# EAGLE schematic AD9910_Finished_3rd (EAGLE 9.6.2)
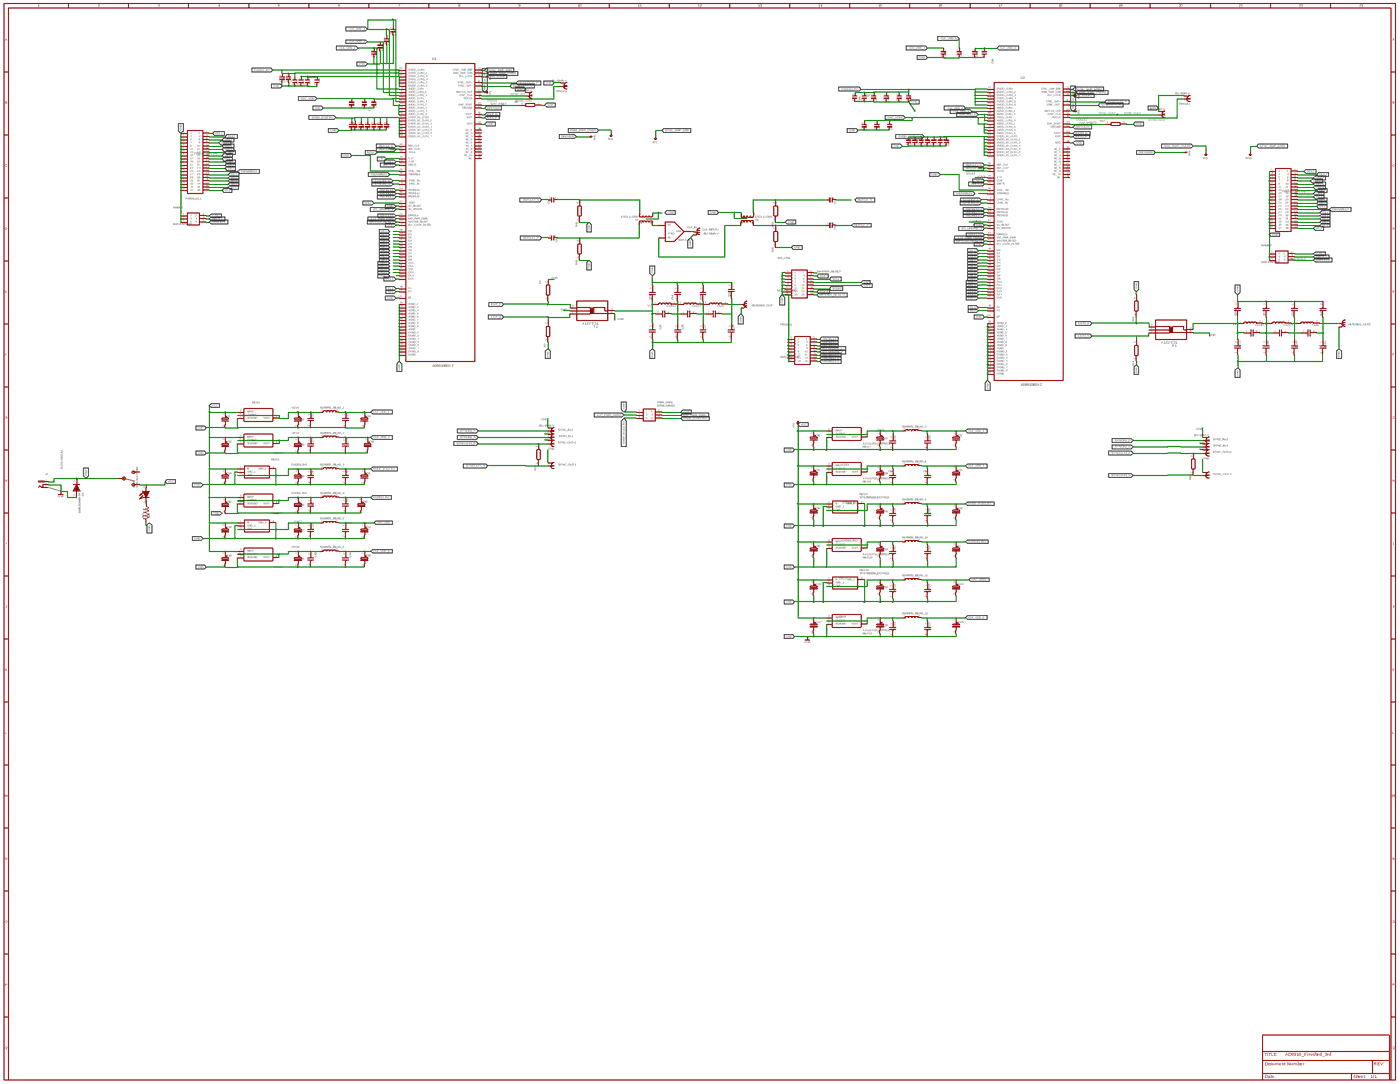
[diagram p0: schematic, sheet 1, overview]
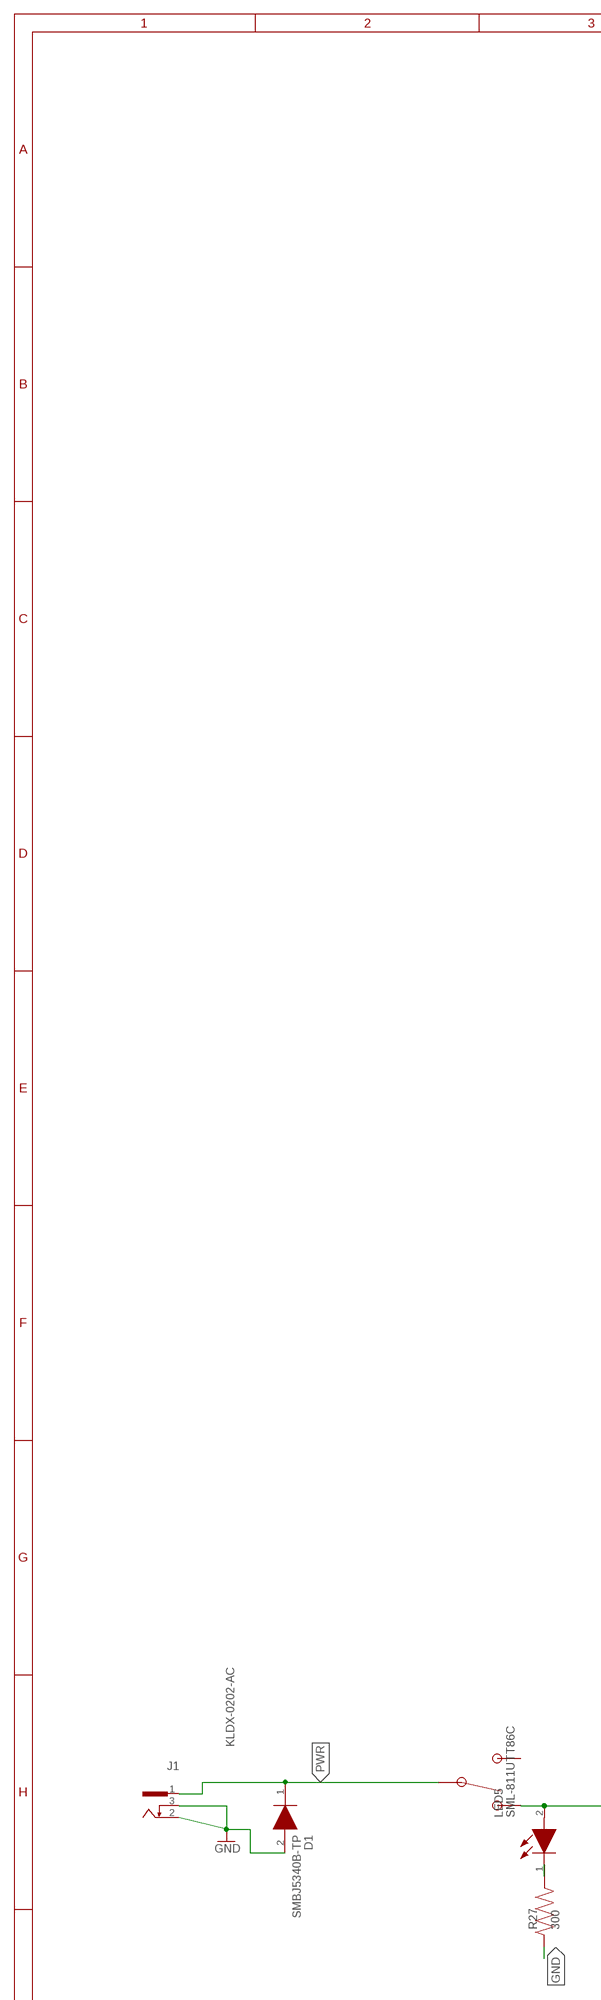
[diagram p1: schematic, sheet 1, part 1 of 7]
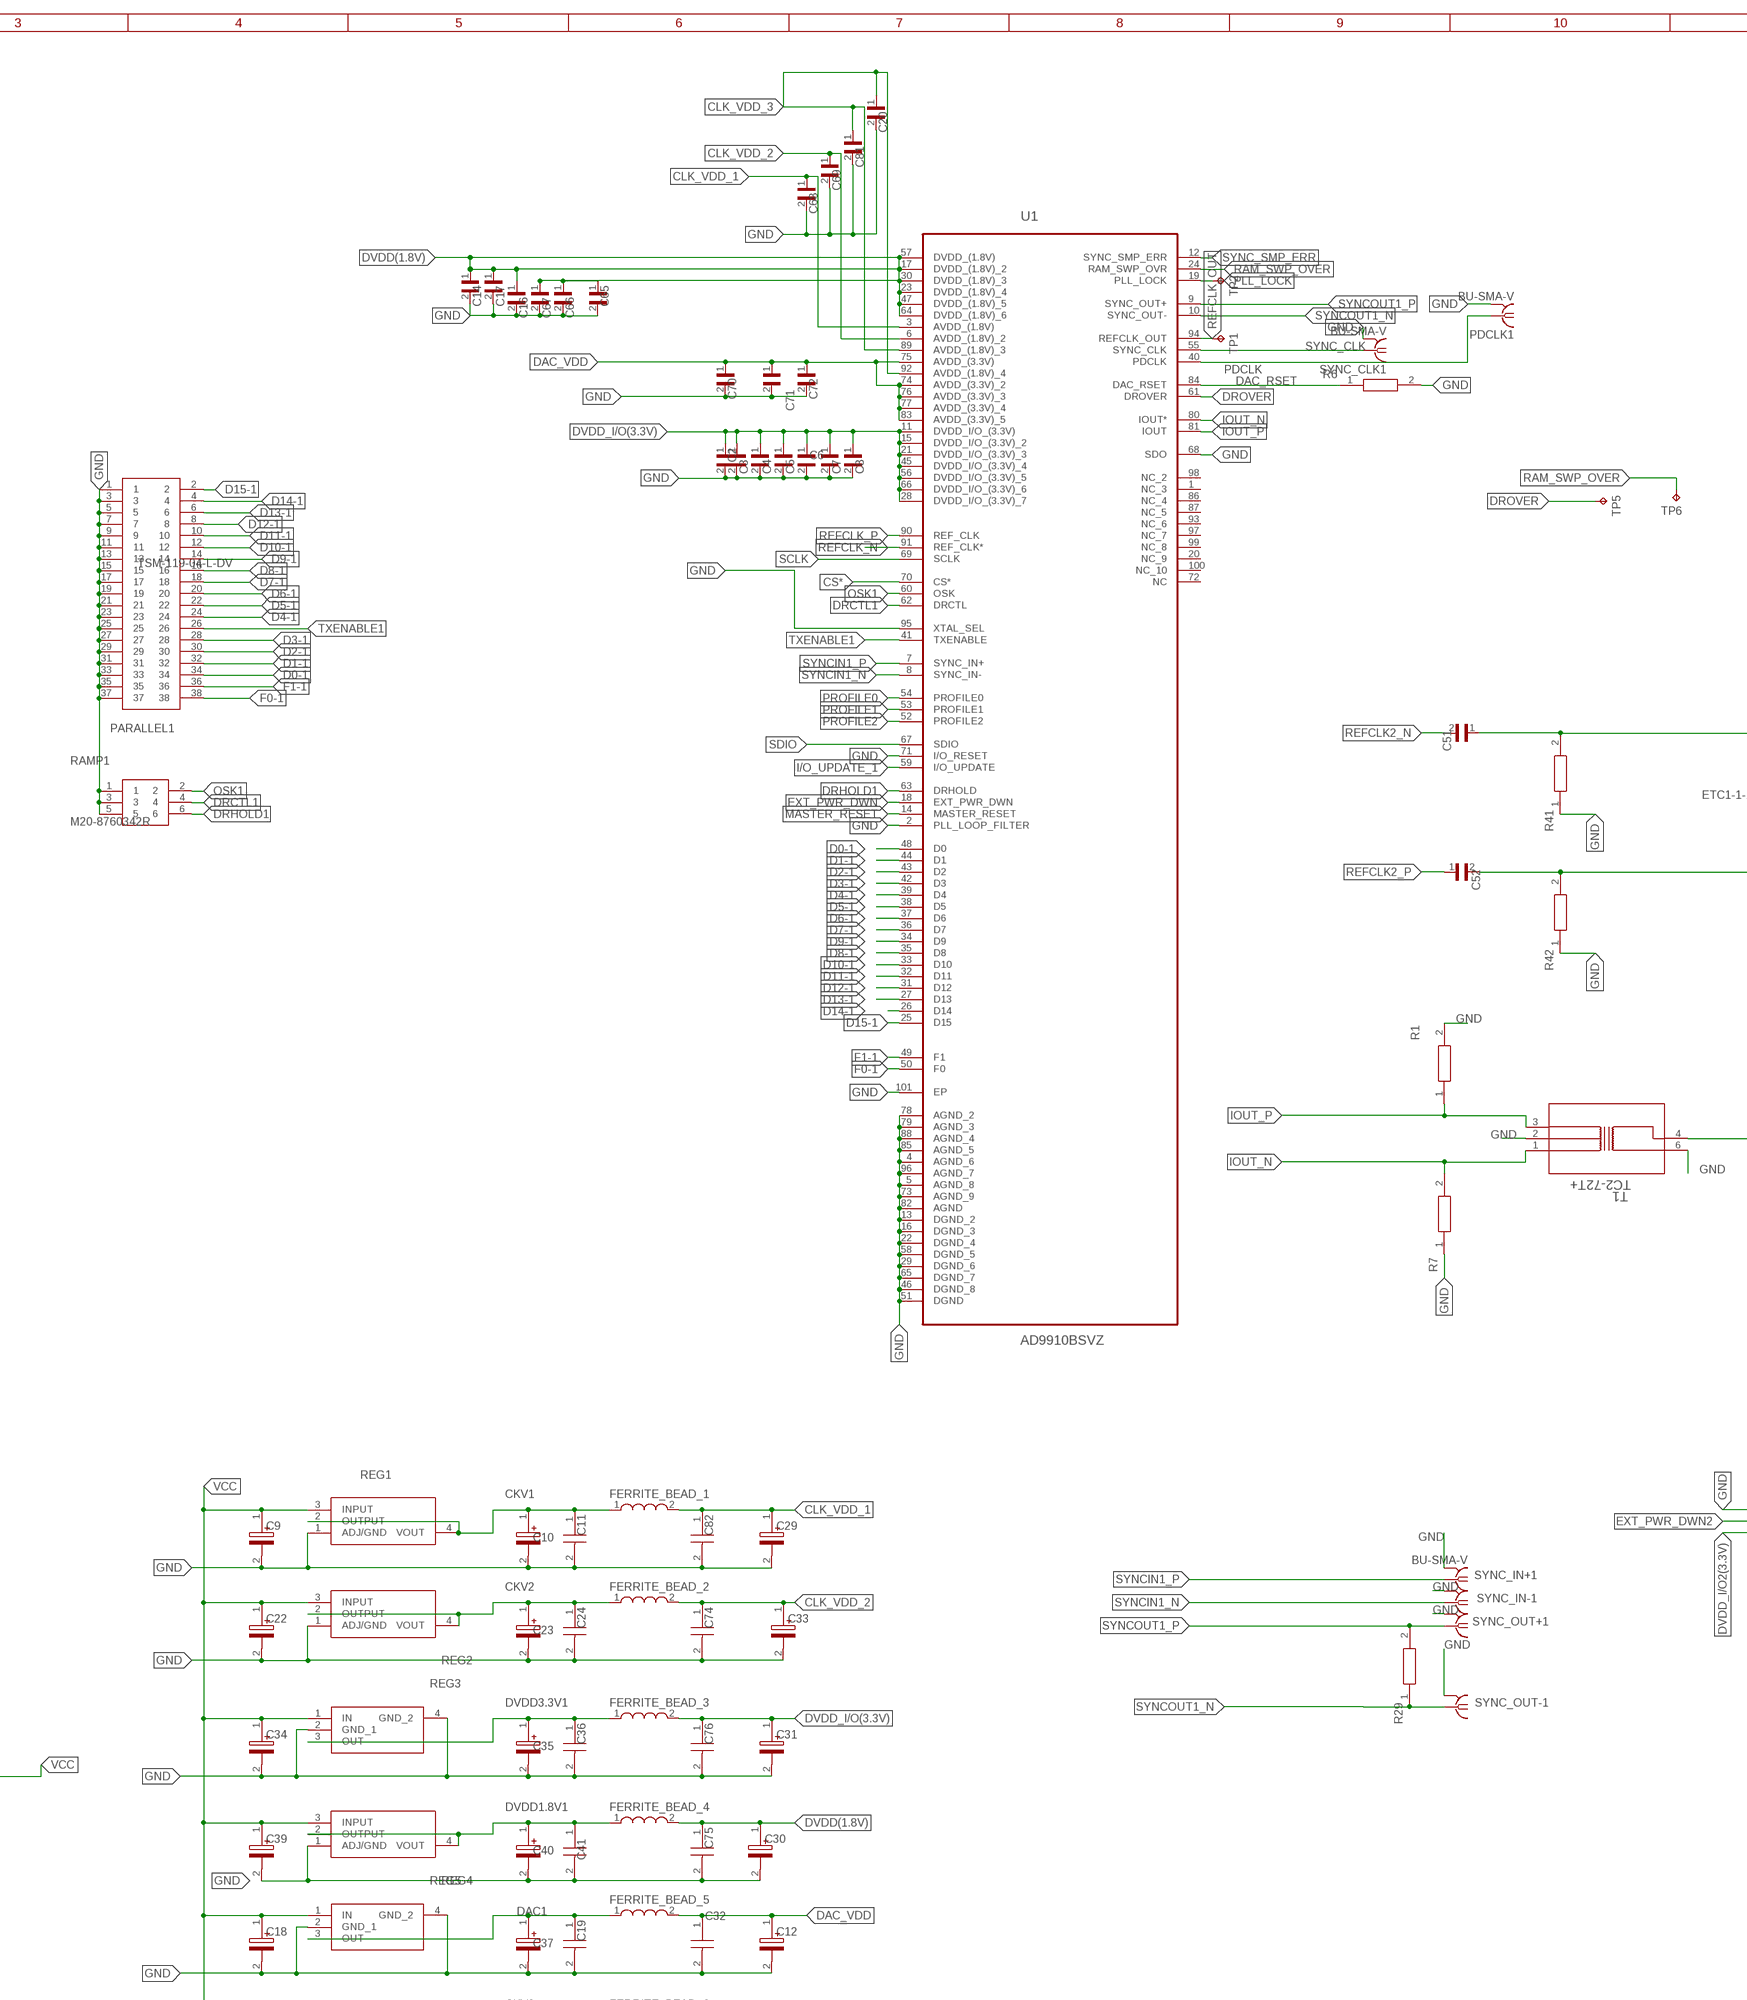
[diagram p2: schematic, sheet 1, part 2 of 7]
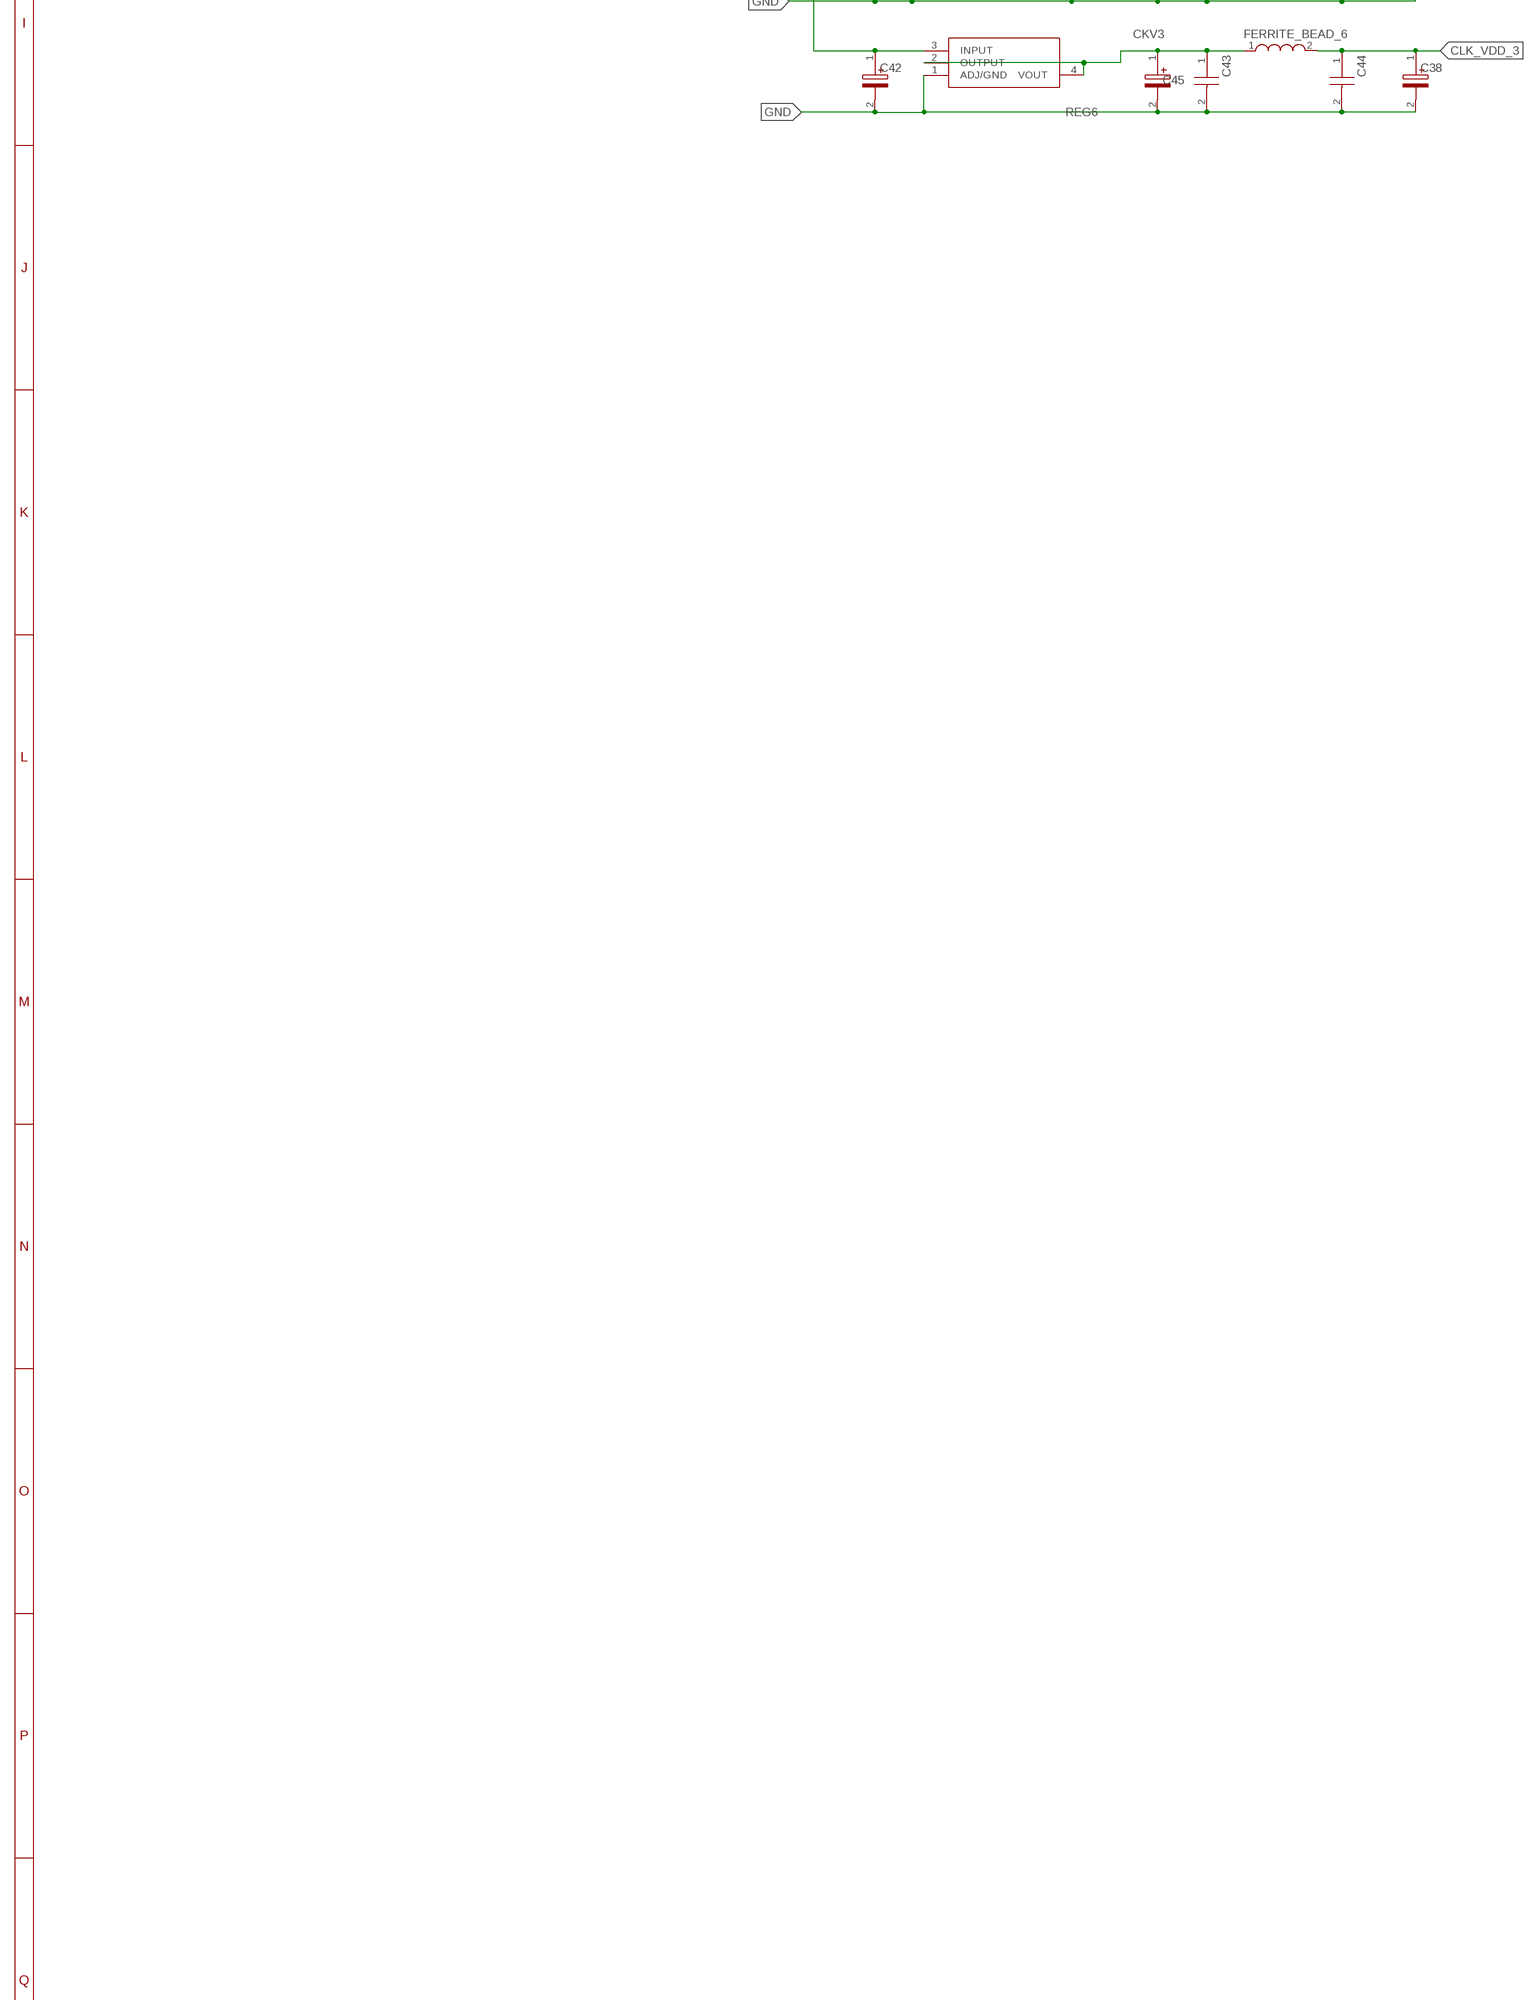
[diagram p3: schematic, sheet 1, part 3 of 7]
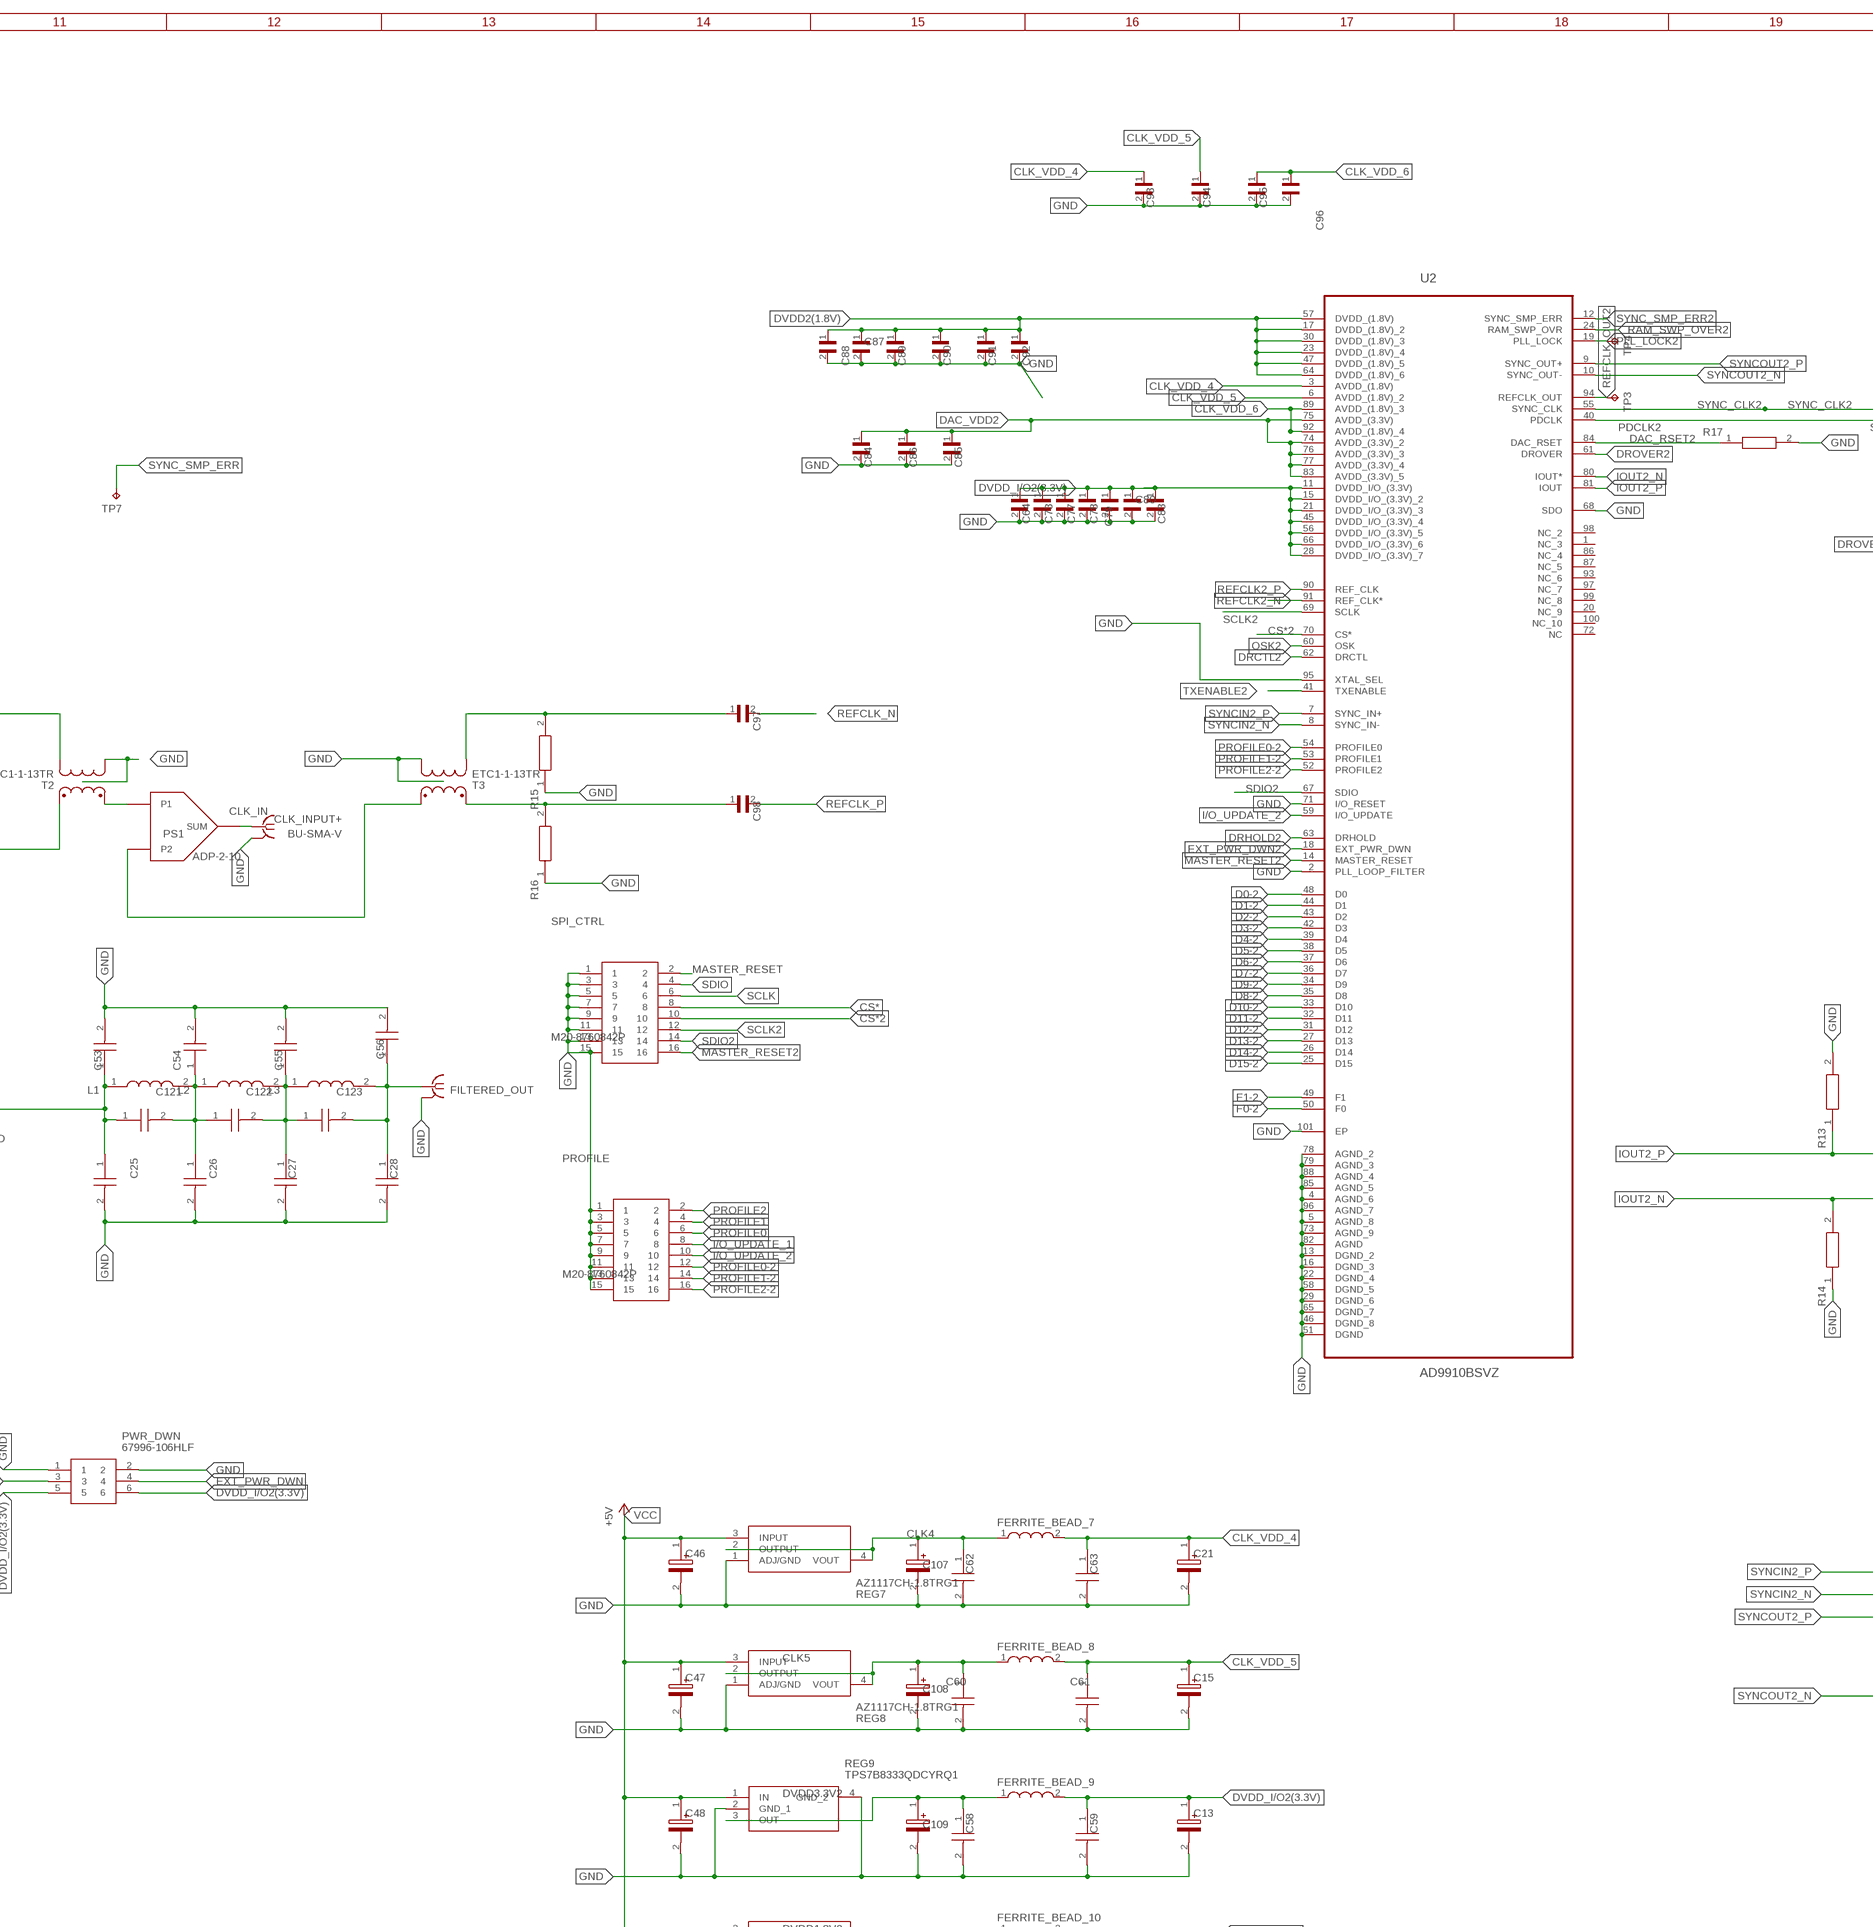
[diagram p4: schematic, sheet 1, part 4 of 7]
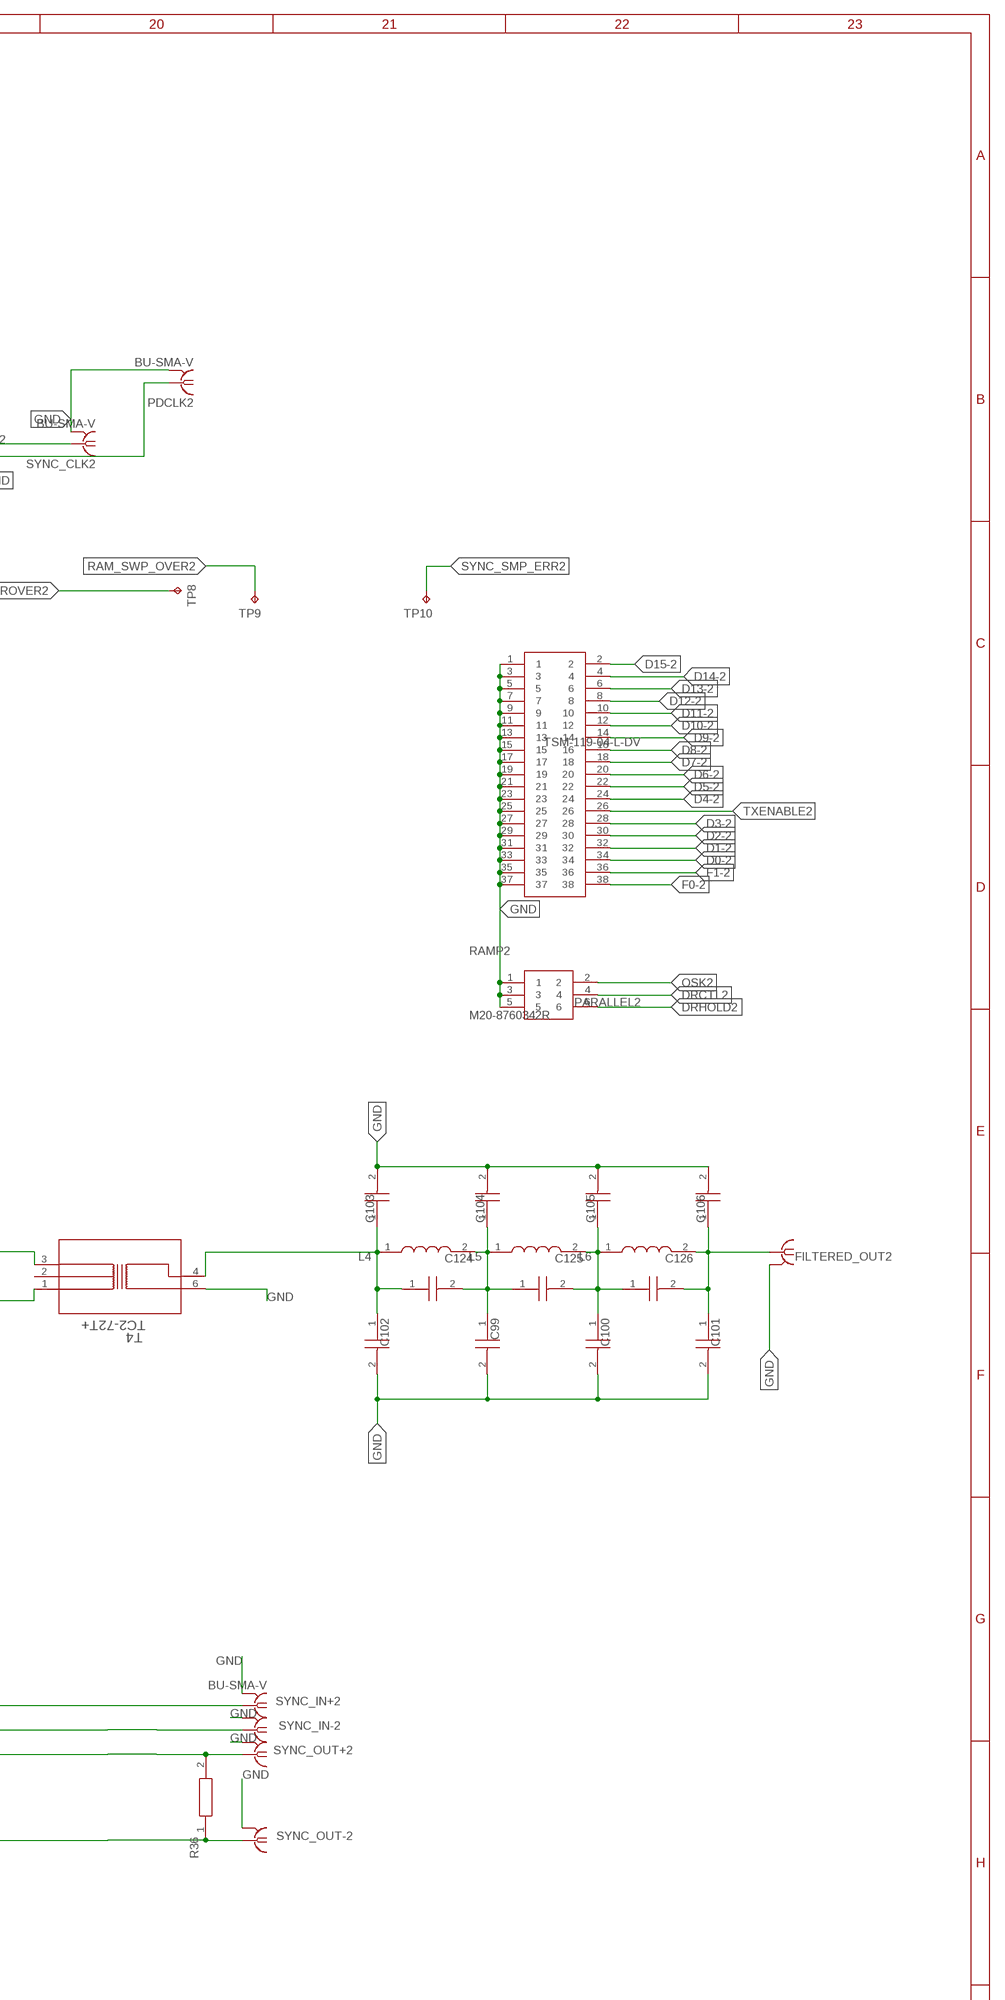
[diagram p5: schematic, sheet 1, part 5 of 7]
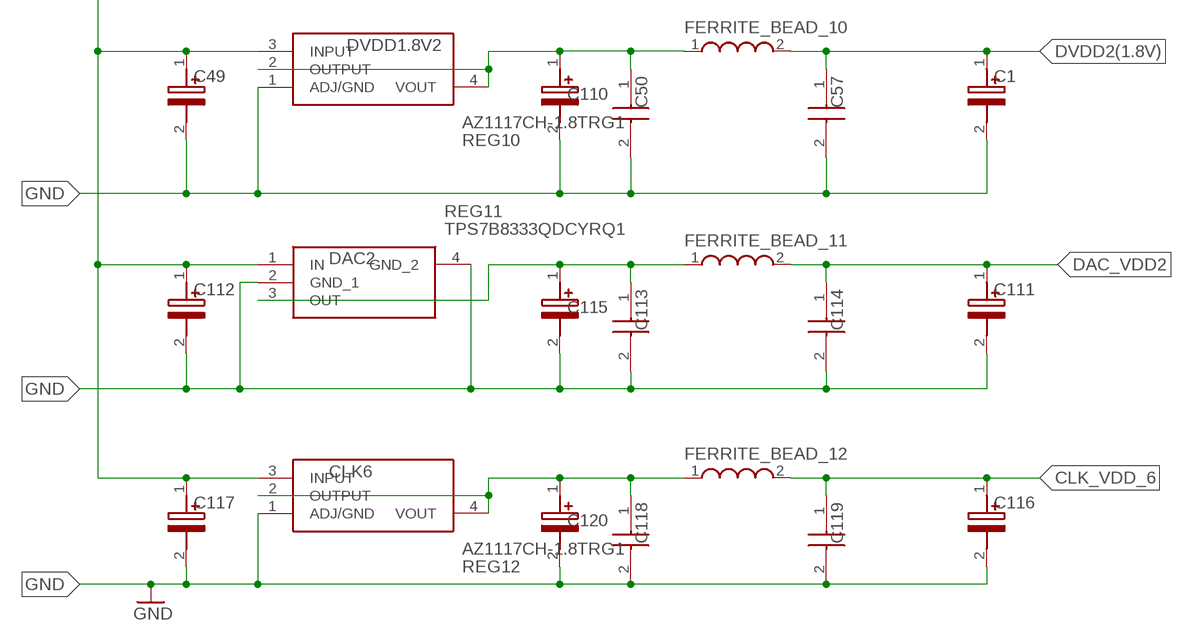
[diagram p6: schematic, sheet 1, part 6 of 7]
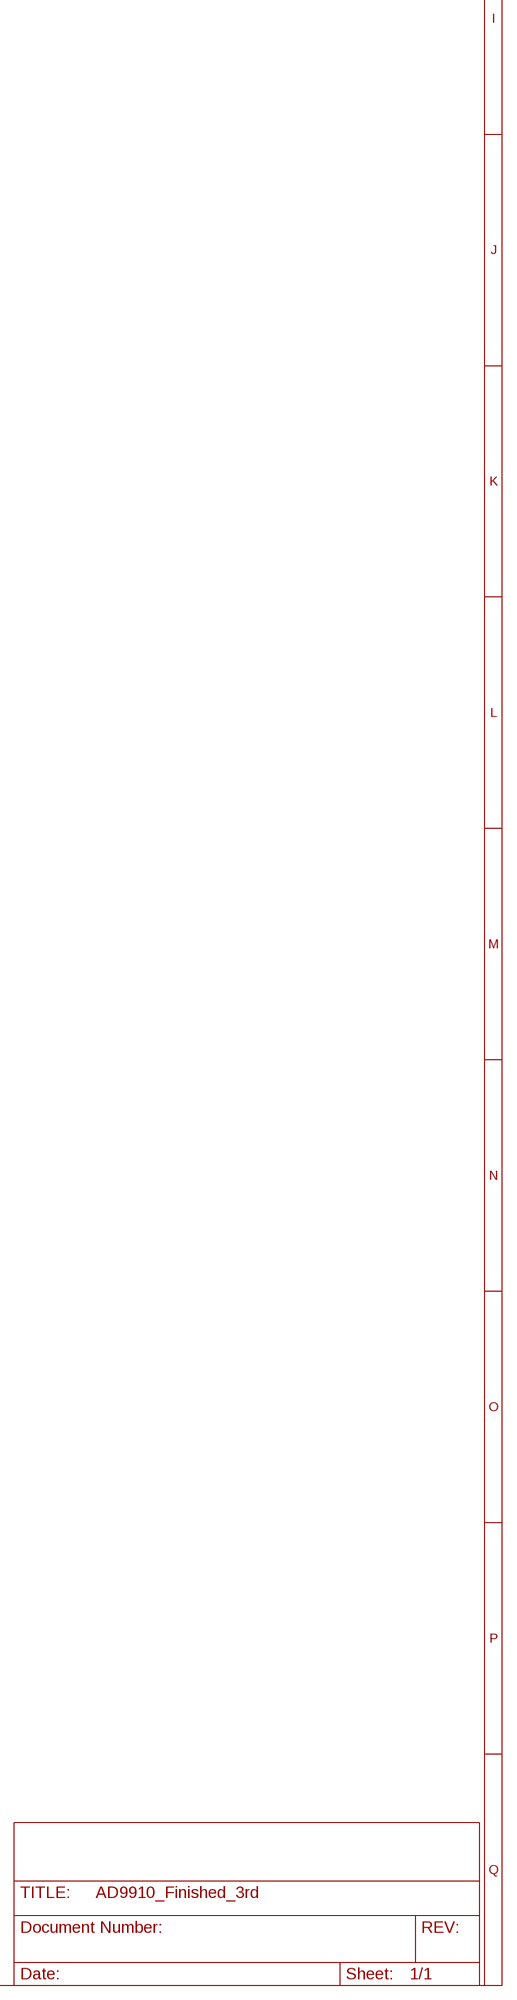
[diagram p7: schematic, sheet 1, part 7 of 7]

## Parts
C1  T489A106K010ATA2K2  [CAPPM3216X180N]
C2  GRM022R60G104ME15L  [CAPC0402X22N]
C3  GRM022R60G104ME15L  [CAPC0402X22N]
C4  GRM022R60G104ME15L  [CAPC0402X22N]
C5  GRM022R60G104ME15L  [CAPC0402X22N]
C6  GRM022R60G104ME15L  [CAPC0402X22N]
C7  GRM022R60G104ME15L  [CAPC0402X22N]
C8  GRM022R60G104ME15L  [CAPC0402X22N]
C9  T489A106K010ATA2K2  [CAPPM3216X180N]
C10  T491A226K010ATAUTO  [CAPPM3216X180N]
C11  GRM152D80G105ME15D  [CAPC1005X22N]
C12  T489A106K010ATA2K2  [CAPPM3216X180N]
C13  T489A106K010ATA2K2  [CAPPM3216X180N]
C14  GRM022R60G104ME15L  [CAPC0402X22N]
C15  T489A106K010ATA2K2  [CAPPM3216X180N]
C16  GRM022R60G104ME15L  [CAPC0402X22N]
C17  GRM022R60G104ME15L  [CAPC0402X22N]
C18  T489A106K010ATA2K2  [CAPPM3216X180N]
C19  GRM152D80G105ME15D  [CAPC1005X22N]
C20  GRM022R60G104ME15L  [CAPC0402X22N]
C21  T489A106K010ATA2K2  [CAPPM3216X180N]
C22  T489A106K010ATA2K2  [CAPPM3216X180N]
C23  T491A226K010ATAUTO  [CAPPM3216X180N]
C24  GRM152D80G105ME15D  [CAPC1005X22N]
C25  GQM2195C2E2R7CB12D  [CAPC2012X100N]
C26  GQM2195C2E5R6CB12D  [CAPC2012X100N]
C27  GQM2195C2E6R8CB12D  [CAPC2012X100N]
C28  GQM2195C2E3R9BB12D  [CAPC2012X100N]
C29  T489A106K010ATA2K2  [CAPPM3216X180N]
C30  T489A106K010ATA2K2  [CAPPM3216X180N]
C31  T489A106K010ATA2K2  [CAPPM3216X180N]
C32  GRM152D80G105ME15D  [CAPC1005X22N]
C33  T489A106K010ATA2K2  [CAPPM3216X180N]
C34  T489A106K010ATA2K2  [CAPPM3216X180N]
C35  T491A226K010ATAUTO  [CAPPM3216X180N]
C36  GRM152D80G105ME15D  [CAPC1005X22N]
C37  T491A226K010ATAUTO  [CAPPM3216X180N]
C38  T489A106K010ATA2K2  [CAPPM3216X180N]
C39  T489A106K010ATA2K2  [CAPPM3216X180N]
C40  T491A226K010ATAUTO  [CAPPM3216X180N]
C41  GRM152D80G105ME15D  [CAPC1005X22N]
C42  T489A106K010ATA2K2  [CAPPM3216X180N]
C43  GRM152D80G105ME15D  [CAPC1005X22N]
C44  GRM152D80G105ME15D  [CAPC1005X22N]
C45  T491A226K010ATAUTO  [CAPPM3216X180N]
C46  T489A106K010ATA2K2  [CAPPM3216X180N]
C47  T489A106K010ATA2K2  [CAPPM3216X180N]
C48  T489A106K010ATA2K2  [CAPPM3216X180N]
C49  T489A106K010ATA2K2  [CAPPM3216X180N]
C50  GRMMDXR60J105ME05D  [CAPC0502X28N]
C51  GRM022R60G104ME15L  [CAPC0402X22N]
C52  GRM022R60G104ME15L  [CAPC0402X22N]
C53  GQM2195C2E2R7CB12D  [CAPC2012X100N]
C54  GQM2195C2E5R6CB12D  [CAPC2012X100N]
C55  GQM2195C2E6R8CB12D  [CAPC2012X100N]
C56  GQM2195C2E3R9BB12D  [CAPC2012X100N]
C57  GRMMDXR60J105ME05D  [CAPC0502X28N]
C58  GRMMDXR60J105ME05D  [CAPC0502X28N]
C59  GRMMDXR60J105ME05D  [CAPC0502X28N]
C60  GRMMDXR60J105ME05D  [CAPC0502X28N]
C61  GRMMDXR60J105ME05D  [CAPC0502X28N]
C62  GRMMDXR60J105ME05D  [CAPC0502X28N]
C63  GRMMDXR60J105ME05D  [CAPC0502X28N]
C64  GRM022R60G104ME15L  [CAPC0402X22N]
C65  GRM022R60G104ME15L  [CAPC0402X22N]
C66  GRM022R60G104ME15L  [CAPC0402X22N]
C67  GRM022R60G104ME15L  [CAPC0402X22N]
C68  GRM022R60G104ME15L  [CAPC0402X22N]
C69  GRM022R60G104ME15L  [CAPC0402X22N]
C70  GRM022R60G104ME15L  [CAPC0402X22N]
C71  GRM022R60G104ME15L  [CAPC0402X22N]
C72  GRM022R60G104ME15L  [CAPC0402X22N]
C73  GRM022R60G104ME15L  [CAPC0402X22N]
C74  GRM152D80G105ME15D  [CAPC1005X22N]
C75  GRM152D80G105ME15D  [CAPC1005X22N]
C76  GRM152D80G105ME15D  [CAPC1005X22N]
C77  GRM022R60G104ME15L  [CAPC0402X22N]
C78  GRM022R60G104ME15L  [CAPC0402X22N]
C79  GRM022R60G104ME15L  [CAPC0402X22N]
C80  GRM022R60G104ME15L  [CAPC0402X22N]
C81  GRM022R60G104ME15L  [CAPC0402X22N]
C82  GRM152D80G105ME15D  [CAPC1005X22N]
C83  GRM022R60G104ME15L  [CAPC0402X22N]
C84  GRM022R60G104ME15L  [CAPC0402X22N]
C85  GRM022R60G104ME15L  [CAPC0402X22N]
C86  GRM022R60G104ME15L  [CAPC0402X22N]
C87  GRM022R60G104ME15L  [CAPC0402X22N]
C88  GRM022R60G104ME15L  [CAPC0402X22N]
C89  GRM022R60G104ME15L  [CAPC0402X22N]
C90  GRM022R60G104ME15L  [CAPC0402X22N]
C91  GRM022R60G104ME15L  [CAPC0402X22N]
C92  GRM022R60G104ME15L  [CAPC0402X22N]
C93  GRM022R60G104ME15L  [CAPC0402X22N]
C94  GRM022R60G104ME15L  [CAPC0402X22N]
C95  GRM022R60G104ME15L  [CAPC0402X22N]
C96  GRM022R60G104ME15L  [CAPC0402X22N]
C97  GRM022R60G104ME15L  [CAPC0402X22N]
C98  GRM022R60G104ME15L  [CAPC0402X22N]
C99  GQM2195C2E5R6CB12D  [CAPC2012X100N]
C100  GQM2195C2E6R8CB12D  [CAPC2012X100N]
C101  GQM2195C2E3R9BB12D  [CAPC2012X100N]
C102  GQM2195C2E2R7CB12D  [CAPC2012X100N]
C103  GQM2195C2E2R7CB12D  [CAPC2012X100N]
C104  GQM2195C2E5R6CB12D  [CAPC2012X100N]
C105  GQM2195C2E6R8CB12D  [CAPC2012X100N]
C106  GQM2195C2E3R9BB12D  [CAPC2012X100N]
C107  T491A226K010ATAUTO  [CAPPM3216X180N]
C108  T491A226K010ATAUTO  [CAPPM3216X180N]
C109  T491A226K010ATAUTO  [CAPPM3216X180N]
C110  T491A226K010ATAUTO  [CAPPM3216X180N]
C111  T489A106K010ATA2K2  [CAPPM3216X180N]
C112  T489A106K010ATA2K2  [CAPPM3216X180N]
C113  GRMMDXR60J105ME05D  [CAPC0502X28N]
C114  GRMMDXR60J105ME05D  [CAPC0502X28N]
C115  T491A226K010ATAUTO  [CAPPM3216X180N]
C116  T489A106K010ATA2K2  [CAPPM3216X180N]
C117  T489A106K010ATA2K2  [CAPPM3216X180N]
C118  GRMMDXR60J105ME05D  [CAPC0502X28N]
C119  GRMMDXR60J105ME05D  [CAPC0502X28N]
C120  T491A226K010ATAUTO  [CAPPM3216X180N]
C121  GQM2195C2E5R6CB12D  [CAPC2012X100N]
C122  GQM2195C2E2R7CB12D  [CAPC2012X100N]
C123  GQM2195C2E1R0BB12D  [CAPC2012X100N]
C124  GQM2195C2E5R6CB12D  [CAPC2012X100N]
C125  GQM2195C2E2R7CB12D  [CAPC2012X100N]
C126  GQM2195C2E1R0BB12D  [CAPC2012X100N]
CLK_INPUT+  BU-SMA-V  [BU-SMA-V]
D1  SMBJ5340B-TP  [DIOM5336X241N]
FERRITE_BEAD_1  WE-CBF_0603(WB/HS)  [WE-CBF_0603(W=2.2)]
FERRITE_BEAD_2  WE-CBF_0603(WB/HS)  [WE-CBF_0603(W=2.2)]
FERRITE_BEAD_3  WE-CBF_0603(WB/HS)  [WE-CBF_0603(W=2.2)]
FERRITE_BEAD_4  WE-CBF_0603(WB/HS)  [WE-CBF_0603(W=2.2)]
FERRITE_BEAD_5  WE-CBF_0603(WB/HS)  [WE-CBF_0603(W=2.2)]
FERRITE_BEAD_6  WE-CBF_0603(WB/HS)  [WE-CBF_0603(W=2.2)]
FERRITE_BEAD_7  WE-CBF_0603(WB/HS)  [WE-CBF_0603(W=2.2)]
FERRITE_BEAD_8  WE-CBF_0603(WB/HS)  [WE-CBF_0603(W=2.2)]
FERRITE_BEAD_9  WE-CBF_0603(WB/HS)  [WE-CBF_0603(W=2.2)]
FERRITE_BEAD_10  WE-CBF_0603(WB/HS)  [WE-CBF_0603(W=2.2)]
FERRITE_BEAD_11  WE-CBF_0603(WB/HS)  [WE-CBF_0603(W=2.2)]
FERRITE_BEAD_12  WE-CBF_0603(WB/HS)  [WE-CBF_0603(W=2.2)]
FILTERED_OUT  BU-SMA-H  [BU-SMA-H]
FILTERED_OUT2  BU-SMA-H  [BU-SMA-H]
J1  KLDX-0202-AC  [KYCON_KLDX-0202-AC]
L1  LQW2BAS18NJ00L  [LQW2BAN11NG00L]
L2  LQW2BAS22NJ00L  [LQW2BAN11NG00L]
L3  LQW2BAS27NJ00L  [LQW2BAN11NG00L]
L4  LQW2BAS18NJ00L  [LQW2BAN11NG00L]
L5  LQW2BAS22NJ00L  [LQW2BAN11NG00L]
L6  LQW2BAS27NJ00L  [LQW2BAN11NG00L]
LED5  SML-811UTT86C  [LEDC3412X115N]
PARALLEL1  TSM-119-04-L-DV  [TSM-119-YY-ZZZ-DV]
PARALLEL2  TSM-119-04-L-DV  [TSM-119-YY-ZZZ-DV]
PDCLK1  BU-SMA-V  [BU-SMA-V]
PDCLK2  BU-SMA-V  [BU-SMA-V]
PROFILE  M20-8760842P  [M208760842P]
PS1  ADP-2-10  [CD636]
PWR_DWN  67996-106HLF  [HDRV6W67P254_2X3_762X483X858P]
R1  TNPW020150R0BEED  [RESC0603X26N]
R6  TNPU040210K0AYEP00  [RESC1005X40N]
R7  TNPW020150R0BEED  [RESC0603X26N]
R13  TNPW020150R0BEED  [RESC0603X26N]
R14  TNPW020150R0BEED  [RESC0603X26N]
R15  CRCW020124R9FNED  [RESC0603X28N]
R16  CRCW020124R9FNED  [RESC0603X28N]
R17  TNPU040210K0AYEP00  [RESC1005X40N]
R27  300  ERA3VEB3000V  [RES_ERA3VEB3000V]
R29  CRCW0402100RFKEDC  [RESC1005X35N]
R36  CRCW0402100RFKEDC  [RESC1005X35N]
R41  CRCW020124R9FNED  [RESC0603X28N]
R42  CRCW020124R9FNED  [RESC0603X28N]
RAMP1  M20-8760342R  [M208760342R]
RAMP2  M20-8760342R  [M208760342R]
REG1  AZ1117CH-1.8TRG1  [SOT230P700X180-4N]
REG2  AZ1117CH-1.8TRG1  [SOT230P700X180-4N]
REG3  TPS7B8333QDCYRQ1  [SOT230P700X180-4N]
REG4  AZ1117CH-1.8TRG1  [SOT230P700X180-4N]
REG5  TPS7B8333QDCYRQ1  [SOT230P700X180-4N]
REG6  AZ1117CH-1.8TRG1  [SOT230P700X180-4N]
REG7  AZ1117CH-1.8TRG1  [SOT230P700X180-4N]
REG8  AZ1117CH-1.8TRG1  [SOT230P700X180-4N]
REG9  TPS7B8333QDCYRQ1  [SOT230P700X180-4N]
REG10  AZ1117CH-1.8TRG1  [SOT230P700X180-4N]
REG11  TPS7B8333QDCYRQ1  [SOT230P700X180-4N]
REG12  AZ1117CH-1.8TRG1  [SOT230P700X180-4N]
SPI_CTRL  M20-8760842P  [M208760842P]
SW1  100SP1T2B4M6QE  [TOGGLE_RA]
SYNC_CLK1  BU-SMA-V  [BU-SMA-V]
SYNC_CLK2  BU-SMA-V  [BU-SMA-V]
SYNC_IN+1  BU-SMA-V  [BU-SMA-V]
SYNC_IN+2  BU-SMA-V  [BU-SMA-V]
SYNC_IN-1  BU-SMA-V  [BU-SMA-V]
SYNC_IN-2  BU-SMA-V  [BU-SMA-V]
SYNC_OUT+1  BU-SMA-V  [BU-SMA-V]
SYNC_OUT+2  BU-SMA-V  [BU-SMA-V]
SYNC_OUT-1  BU-SMA-V  [BU-SMA-V]
SYNC_OUT-2  BU-SMA-V  [BU-SMA-V]
T1  TC2-72T+  [AT1521_MNC]
T2  ETC1-1-13TR  [SM22]
T3  ETC1-1-13TR  [SM22]
T4  TC2-72T+  [AT1521_MNC]
TP1  TPPAD1-13  [P1-13]
TP2  TPPAD1-13  [P1-13]
TP3  TPPAD1-13  [P1-13]
TP4  TPPAD1-13  [P1-13]
TP5  TPPAD1-13  [P1-13]
TP6  TPPAD1-13  [P1-13]
TP7  TPPAD1-13  [P1-13]
TP8  TPPAD1-13  [P1-13]
TP9  TPPAD1-13  [P1-13]
TP10  TPPAD1-13  [P1-13]
U1  AD9910BSVZ  [QFP50P1600X1600X120-101N]
U2  AD9910BSVZ  [QFP50P1600X1600X120-101N]

## Nets
CKV1 [single]: C10.1(+) C11.1 FERRITE_BEAD_1.1 REG1.2(OUTPUT) REG1.4(VOUT)
CKV2 [single]: C23.1(+) C24.1 FERRITE_BEAD_2.1 REG2.2(OUTPUT) REG2.4(VOUT)
CKV3 [single]: C43.1 C45.1(+) FERRITE_BEAD_6.1 REG6.2(OUTPUT) REG6.4(VOUT)
CLK4 [single]: C62.1 C107.1(+) FERRITE_BEAD_7.1 REG7.2(OUTPUT) REG7.4(VOUT)
CLK5 [single]: C60.1 C108.1(+) FERRITE_BEAD_8.1 REG8.2(OUTPUT) REG8.4(VOUT)
CLK6 [single]: C118.1 C120.1(+) FERRITE_BEAD_12.1 REG12.2(OUTPUT) REG12.4(VOUT)
CLK_IN [single]: CLK_INPUT+.1 PS1.1(SUM)
CLK_VDD_1 [single]: C29.1(+) C68.1 C82.1 FERRITE_BEAD_1.2 U1.3(AVDD_(1.8V))
CLK_VDD_2 [single]: C33.1(+) C69.1 C74.1 FERRITE_BEAD_2.2 U1.6(AVDD_(1.8V)_2)
CLK_VDD_3 [single]: C20.1 C38.1(+) C44.1 C81.1 FERRITE_BEAD_6.2 U1.89(AVDD_(1.8V)_3) U1.92(AVDD_(1.8V)_4)
CLK_VDD_4 [single]: C21.1(+) C63.1 C93.1 FERRITE_BEAD_7.2 U2.3(AVDD_(1.8V))
CLK_VDD_5 [single]: C15.1(+) C61.1 C94.1 FERRITE_BEAD_8.2 U2.6(AVDD_(1.8V)_2)
CLK_VDD_6 [single]: C95.1 C96.1 C116.1(+) C119.1 FERRITE_BEAD_12.2 U2.89(AVDD_(1.8V)_3) U2.92(AVDD_(1.8V)_4)
CS* [single]: SPI_CTRL.8 U1.70(CS*)
CS*2 [single]: SPI_CTRL.10 U2.70(CS*)
D0-1 [single]: PARALLEL1.34 U1.48(D0)
D0-2 [single]: PARALLEL2.34 U2.48(D0)
D1-1 [single]: PARALLEL1.32 U1.44(D1)
D1-2 [single]: PARALLEL2.32 U2.44(D1)
D2-1 [single]: PARALLEL1.30 U1.43(D2)
D2-2 [single]: PARALLEL2.30 U2.43(D2)
D3-1 [single]: PARALLEL1.28 U1.42(D3)
D3-2 [single]: PARALLEL2.28 U2.42(D3)
D4-1 [single]: PARALLEL1.24 U1.39(D4)
D4-2 [single]: PARALLEL2.24 U2.39(D4)
D5-1 [single]: PARALLEL1.22 U1.38(D5)
D5-2 [single]: PARALLEL2.22 U2.38(D5)
D6-1 [single]: PARALLEL1.20 U1.37(D6)
D6-2 [single]: PARALLEL2.20 U2.37(D6)
D7-1 [single]: PARALLEL1.18 U1.36(D7)
D7-2 [single]: PARALLEL2.18 U2.36(D7)
D8-1 [single]: PARALLEL1.16 U1.35(D8)
D8-2 [single]: PARALLEL2.16 U2.35(D8)
D9-1 [single]: PARALLEL1.14 U1.34(D9)
D9-2 [single]: PARALLEL2.14 U2.34(D9)
D10-1 [single]: PARALLEL1.12 U1.33(D10)
D10-2 [single]: PARALLEL2.12 U2.33(D10)
D11-1 [single]: PARALLEL1.10 U1.32(D11)
D11-2 [single]: PARALLEL2.10 U2.32(D11)
D12-1 [single]: PARALLEL1.8 U1.31(D12)
D12-2 [single]: PARALLEL2.8 U2.31(D12)
D13-1 [single]: PARALLEL1.6 U1.27(D13)
D13-2 [single]: PARALLEL2.6 U2.27(D13)
D14-1 [single]: PARALLEL1.4 U1.26(D14)
D14-2 [single]: PARALLEL2.4 U2.26(D14)
D15-1 [single]: PARALLEL1.2 U1.25(D15)
D15-2 [single]: PARALLEL2.2 U2.25(D15)
DAC1 [single]: C19.1 C37.1(+) FERRITE_BEAD_5.1 REG5.3(OUT)
DAC2 [single]: C113.1 C115.1(+) FERRITE_BEAD_11.1 REG11.3(OUT)
DAC_RSET [single]: R6.1 U1.84(DAC_RSET)
DAC_RSET2 [single]: R17.1 U2.84(DAC_RSET)
DAC_VDD [single]: C12.1(+) C32.1 C70.1 C71.1 C72.1 FERRITE_BEAD_5.2 U1.74(AVDD_(3.3V)_2) U1.75(AVDD_(3.3V)) U1.76(AVDD_(3.3V)_3) U1.77(AVDD_(3.3V)_4) U1.83(AVDD_(3.3V)_5)
DAC_VDD2 [single]: C84.1 C85.1 C86.1 C111.1(+) C114.1 FERRITE_BEAD_11.2 U2.74(AVDD_(3.3V)_2) U2.75(AVDD_(3.3V)) U2.76(AVDD_(3.3V)_3) U2.77(AVDD_(3.3V)_4) U2.83(AVDD_(3.3V)_5)
DRCTL1 [single]: RAMP1.4 U1.62(DRCTL)
DRCTL2 [single]: RAMP2.4 U2.62(DRCTL)
DRHOLD1 [single]: RAMP1.6 U1.63(DRHOLD)
DRHOLD2 [single]: RAMP2.6 U2.63(DRHOLD)
DROVER [single]: TP5.TP U1.61(DROVER)
DROVER2 [single]: TP8.TP U2.61(DROVER)
DVDD1.8V1 [single]: C40.1(+) C41.1 FERRITE_BEAD_4.1 REG4.2(OUTPUT) REG4.4(VOUT)
DVDD1.8V2 [single]: C50.1 C110.1(+) FERRITE_BEAD_10.1 REG10.2(OUTPUT) REG10.4(VOUT)
DVDD2(1.8V) [single]: C1.1(+) C57.1 C87.1 C88.1 C89.1 C90.1 C91.1 C92.1 FERRITE_BEAD_10.2 U2.17(DVDD_(1.8V)_2) U2.23(DVDD_(1.8V)_4) U2.30(DVDD_(1.8V)_3) U2.47(DVDD_(1.8V)_5) U2.57(DVDD_(1.8V)) U2.64(DVDD_(1.8V)_6)
DVDD3.3V1 [single]: C35.1(+) C36.1 FERRITE_BEAD_3.1 REG3.3(OUT)
DVDD3.3V2 [single]: C58.1 C109.1(+) FERRITE_BEAD_9.1 REG9.3(OUT)
DVDD(1.8V) [single]: C14.1 C16.1 C17.1 C30.1(+) C65.1 C66.1 C67.1 C75.1 FERRITE_BEAD_4.2 U1.17(DVDD_(1.8V)_2) U1.23(DVDD_(1.8V)_4) U1.30(DVDD_(1.8V)_3) U1.47(DVDD_(1.8V)_5) U1.57(DVDD_(1.8V)) U1.64(DVDD_(1.8V)_6)
DVDD_I/O2(3.3V) [single]: C13.1(+) C59.1 C64.1 C73.1 C77.1 C78.1 C79.1 C80.1 C83.1 FERRITE_BEAD_9.2 PWR_DWN.5 PWR_DWN.6 U2.11(DVDD_I/O_(3.3V)) U2.15(DVDD_I/O_(3.3V)_2) U2.21(DVDD_I/O_(3.3V)_3) U2.28(DVDD_I/O_(3.3V)_7) U2.45(DVDD_I/O_(3.3V)_4) U2.56(DVDD_I/O_(3.3V)_5) U2.66(DVDD_I/O_(3.3V)_6)
DVDD_I/O(3.3V) [single]: C2.1 C3.1 C4.1 C5.1 C6.1 C7.1 C8.1 C31.1(+) C76.1 FERRITE_BEAD_3.2 U1.11(DVDD_I/O_(3.3V)) U1.15(DVDD_I/O_(3.3V)_2) U1.21(DVDD_I/O_(3.3V)_3) U1.28(DVDD_I/O_(3.3V)_7) U1.45(DVDD_I/O_(3.3V)_4) U1.56(DVDD_I/O_(3.3V)_5) U1.66(DVDD_I/O_(3.3V)_6)
EXT_PWR_DWN [single]: PWR_DWN.4 U1.18(EXT_PWR_DWN)
EXT_PWR_DWN2 [single]: PWR_DWN.3 U2.18(EXT_PWR_DWN)
F0-1 [single]: PARALLEL1.38 U1.50(F0)
F0-2 [single]: PARALLEL2.38 U2.50(F0)
F1-1 [single]: PARALLEL1.36 U1.49(F1)
F1-2 [single]: PARALLEL2.36 U2.49(F1)
GND [ground]: C1.2(-) C2.2 C3.2 C4.2 C5.2 C6.2 C7.2 C8.2 C9.2(-) C10.2(-) C11.2 C12.2(-) C13.2(-) C14.2 C15.2(-) C16.2 C17.2 C18.2(-) C19.2 C20.2 C21.2(-) C22.2(-) C23.2(-) C24.2 C25.2 C26.2 C27.2 C28.2 C29.2(-) C30.2(-) C31.2(-) C32.2 C33.2(-) C34.2(-) C35.2(-) C36.2 C37.2(-) C38.2(-) C39.2(-) C40.2(-) C41.2 C42.2(-) C43.2 C44.2 C45.2(-) C46.2(-) C47.2(-) C48.2(-) C49.2(-) C50.2 C53.2 C54.2 C55.2 C56.2 C57.2 C58.2 C59.2 C60.2 C61.2 C62.2 C63.2 C64.2 C65.2 C66.2 C67.2 C68.2 C69.2 C70.2 C71.2 C72.2 C73.2 C74.2 C75.2 C76.2 C77.2 C78.2 C79.2 C80.2 C81.2 C82.2 C83.2 C84.2 C85.2 C86.2 C87.2 C88.2 C89.2 C90.2 C91.2 C92.2 C93.2 C94.2 C95.2 C96.2 C99.2 C100.2 C101.2 C102.2 C103.2 C104.2 C105.2 C106.2 C107.2(-) C108.2(-) C109.2(-) C110.2(-) C111.2(-) C112.2(-) C113.2 C114.2 C115.2(-) C116.2(-) C117.2(-) C118.2 C119.2 C120.2(-) CLK_INPUT+.2 CLK_INPUT+.3 CLK_INPUT+.4 CLK_INPUT+.5 D1.2(A) FILTERED_OUT2.2 FILTERED_OUT2.3 FILTERED_OUT2.4 FILTERED_OUT2.5 FILTERED_OUT.2 FILTERED_OUT.3 FILTERED_OUT.4 FILTERED_OUT.5 J1.2 J1.3 PARALLEL1.1 PARALLEL1.3 PARALLEL1.5 PARALLEL1.7 PARALLEL1.9 PARALLEL1.11 PARALLEL1.13 PARALLEL1.15 PARALLEL1.17 PARALLEL1.19 PARALLEL1.21 PARALLEL1.23 PARALLEL1.25 PARALLEL1.27 PARALLEL1.29 PARALLEL1.31 PARALLEL1.33 PARALLEL1.35 PARALLEL1.37 PARALLEL2.1 PARALLEL2.3 PARALLEL2.5 PARALLEL2.7 PARALLEL2.9 PARALLEL2.11 PARALLEL2.13 PARALLEL2.15 PARALLEL2.17 PARALLEL2.19 PARALLEL2.21 PARALLEL2.23 PARALLEL2.25 PARALLEL2.27 PARALLEL2.29 PARALLEL2.31 PARALLEL2.33 PARALLEL2.35 PARALLEL2.37 PDCLK1.2 PDCLK1.3 PDCLK1.4 PDCLK1.5 PDCLK2.2 PDCLK2.3 PDCLK2.4 PDCLK2.5 PROFILE.1 PROFILE.3 PROFILE.5 PROFILE.7 PROFILE.9 PROFILE.11 PROFILE.13 PROFILE.15 PWR_DWN.1 PWR_DWN.2 R1.2 R6.2 R7.1 R13.2 R14.1 R15.1 R16.1 R17.2 R27.1 R41.1 R42.1 RAMP1.1 RAMP1.3 RAMP1.5 RAMP2.1 RAMP2.3 RAMP2.5 REG1.1(ADJ/GND) REG2.1(ADJ/GND) REG3.2(GND_1) REG3.4(GND_2) REG4.1(ADJ/GND) REG5.2(GND_1) REG5.4(GND_2) REG6.1(ADJ/GND) REG7.1(ADJ/GND) REG8.1(ADJ/GND) REG9.2(GND_1) REG9.4(GND_2) REG10.1(ADJ/GND) REG11.2(GND_1) REG11.4(GND_2) REG12.1(ADJ/GND) SPI_CTRL.1 SPI_CTRL.3 SPI_CTRL.5 SPI_CTRL.7 SPI_CTRL.9 SPI_CTRL.11 SPI_CTRL.13 SPI_CTRL.15 SYNC_CLK1.2 SYNC_CLK1.3 SYNC_CLK1.4 SYNC_CLK1.5 SYNC_CLK2.2 SYNC_CLK2.3 SYNC_CLK2.4 SYNC_CLK2.5 SYNC_IN+1.2 SYNC_IN+1.3 SYNC_IN+1.4 SYNC_IN+1.5 SYNC_IN+2.2 SYNC_IN+2.3 SYNC_IN+2.4 SYNC_IN+2.5 SYNC_IN-1.2 SYNC_IN-1.3 SYNC_IN-1.4 SYNC_IN-1.5 SYNC_IN-2.2 SYNC_IN-2.3 SYNC_IN-2.4 SYNC_IN-2.5 SYNC_OUT+1.2 SYNC_OUT+1.3 SYNC_OUT+1.4 SYNC_OUT+1.5 SYNC_OUT+2.2 SYNC_OUT+2.3 SYNC_OUT+2.4 SYNC_OUT+2.5 SYNC_OUT-1.2 SYNC_OUT-1.3 SYNC_OUT-1.4 SYNC_OUT-1.5 SYNC_OUT-2.2 SYNC_OUT-2.3 SYNC_OUT-2.4 SYNC_OUT-2.5 T1.2 T1.6 T2.2 T2.4 T3.2 T3.4 T4.6 U1.2(PLL_LOOP_FILTER) U1.4(AGND_6) U1.5(AGND_8) U1.13(DGND_2) U1.16(DGND_3) U1.22(DGND_4) U1.29(DGND_6) U1.46(DGND_8) U1.51(DGND) U1.58(DGND_5) U1.65(DGND_7) U1.68(SDO) U1.71(I/O_RESET) U1.73(AGND_9) U1.78(AGND_2) U1.79(AGND_3) U1.82(AGND) U1.85(AGND_5) U1.88(AGND_4) U1.95(XTAL_SEL) U1.96(AGND_7) U1.101(EP) U2.2(PLL_LOOP_FILTER) U2.4(AGND_6) U2.5(AGND_8) U2.13(DGND_2) U2.16(DGND_3) U2.22(DGND_4) U2.29(DGND_6) U2.46(DGND_8) U2.51(DGND) U2.58(DGND_5) U2.65(DGND_7) U2.68(SDO) U2.71(I/O_RESET) U2.73(AGND_9) U2.78(AGND_2) U2.79(AGND_3) U2.82(AGND) U2.85(AGND_5) U2.88(AGND_4) U2.95(XTAL_SEL) U2.96(AGND_7) U2.101(EP)
I/O_UPDATE_1 [single]: PROFILE.8 U1.59(I/O_UPDATE)
I/O_UPDATE_2 [single]: PROFILE.10 U2.59(I/O_UPDATE)
IOUT2_N [diff]: R14.2 T4.1 U2.80(IOUT*)
IOUT2_P [diff]: R13.1 T4.3 U2.81(IOUT)
IOUT_N [diff]: R7.2 T1.1 U1.80(IOUT*)
IOUT_P [diff]: R1.1 T1.3 U1.81(IOUT)
MASTER_RESET [single]: SPI_CTRL.2 U1.14(MASTER_RESET)
MASTER_RESET2 [single]: SPI_CTRL.16 U2.14(MASTER_RESET)
N5 [single]: C51.1 R41.2 T2.3
N$1 [single]: PS1.3(P1) T2.5
N$5 [single]: PS1.4(P2) T3.5
N$6 [single]: C102.1 C103.1 C124.1 L4.1 T4.4
N$7 [single]: C99.1 C104.1 C124.2 C125.1 L4.2 L5.1
N$8 [single]: C100.1 C105.1 C125.2 C126.1 L5.2 L6.1
N$9 [single]: C101.1 C106.1 C126.2 FILTERED_OUT2.1 L6.2
N$20 [single]: C98.1 R16.2 T3.1
N$22 [single]: C97.1 R15.2 T3.3
N$26 [single]: LED5.1(K) R27.2
N$32 [single]: C52.2 R42.2 T2.1
N$36 [single]: C25.1 C53.1 C121.1 L1.1 T1.4
N$40 [single]: C26.1 C54.1 C121.2 C122.1 L1.2 L2.1
N$41 [single]: C27.1 C55.1 C122.2 C123.1 L2.2 L3.1
N$42 [single]: C28.1 C56.1 C123.2 FILTERED_OUT.1 L3.2
OSK1 [single]: RAMP1.2 U1.60(OSK)
OSK2 [single]: RAMP2.2 U2.60(OSK)
PDCLK [single]: PDCLK1.1 U1.40(PDCLK)
PDCLK2 [single]: PDCLK2.1 U2.40(PDCLK)
PLL_LOCK [single]: TP2.TP U1.19(PLL_LOCK)
PLL_LOCK2 [single]: TP4.TP U2.19(PLL_LOCK)
PROFILE0 [single]: PROFILE.6 U1.54(PROFILE0)
PROFILE0-2 [single]: PROFILE.12 U2.54(PROFILE0)
PROFILE1 [single]: PROFILE.4 U1.53(PROFILE1)
PROFILE1-2 [single]: PROFILE.14 U2.53(PROFILE1)
PROFILE2 [single]: PROFILE.2 U1.52(PROFILE2)
PROFILE2-2 [single]: PROFILE.16 U2.52(PROFILE2)
PWR [single]: D1.1(K) J1.1 SW1.2(COM)
RAM_SWP_OVER [single]: TP6.TP U1.24(RAM_SWP_OVR)
RAM_SWP_OVER2 [single]: TP9.TP U2.24(RAM_SWP_OVR)
REFCLK2_N [diff]: C51.2 U2.91(REF_CLK*)
REFCLK2_P [diff]: C52.1 U2.90(REF_CLK)
REFCLK_N [diff]: C97.2 U1.91(REF_CLK*)
REFCLK_OUT [single]: TP1.TP U1.94(REFCLK_OUT)
REFCLK_OUT2 [single]: TP3.TP U2.94(REFCLK_OUT)
REFCLK_P [diff]: C98.2 U1.90(REF_CLK)
SCLK [single]: SPI_CTRL.6 U1.69(SCLK)
SCLK2 [single]: SPI_CTRL.12 U2.69(SCLK)
SDIO [single]: SPI_CTRL.4 U1.67(SDIO)
SDIO2 [single]: SPI_CTRL.14 U2.67(SDIO)
SYNC_CLK [single]: SYNC_CLK1.1 U1.55(SYNC_CLK)
SYNC_CLK2 [single]: SYNC_CLK2.1 U2.55(SYNC_CLK)
SYNC_SMP_ERR [single]: TP7.TP U1.12(SYNC_SMP_ERR)
SYNC_SMP_ERR2 [single]: TP10.TP U2.12(SYNC_SMP_ERR)
SYNCIN1_N [diff]: SYNC_IN-1.1 U1.8(SYNC_IN-)
SYNCIN1_P [diff]: SYNC_IN+1.1 U1.7(SYNC_IN+)
SYNCIN2_N [diff]: SYNC_IN-2.1 U2.8(SYNC_IN-)
SYNCIN2_P [diff]: SYNC_IN+2.1 U2.7(SYNC_IN+)
SYNCOUT1_N [diff]: R29.1 SYNC_OUT-1.1 U1.10(SYNC_OUT-)
SYNCOUT1_P [diff]: R29.2 SYNC_OUT+1.1 U1.9(SYNC_OUT+)
SYNCOUT2_N [diff]: R36.1 SYNC_OUT-2.1 U2.10(SYNC_OUT-)
SYNCOUT2_P [diff]: R36.2 SYNC_OUT+2.1 U2.9(SYNC_OUT+)
TXENABLE1 [single]: PARALLEL1.26 U1.41(TXENABLE)
TXENABLE2 [single]: PARALLEL2.26 U2.41(TXENABLE)
VCC [single]: C9.1(+) C18.1(+) C22.1(+) C34.1(+) C39.1(+) C42.1(+) C46.1(+) C47.1(+) C48.1(+) C49.1(+) C112.1(+) C117.1(+) LED5.2(A) REG1.3(INPUT) REG2.3(INPUT) REG3.1(IN) REG4.3(INPUT) REG5.1(IN) REG6.3(INPUT) REG7.3(INPUT) REG8.3(INPUT) REG9.1(IN) REG10.3(INPUT) REG11.1(IN) REG12.3(INPUT) SW1.3 ; supply symbol labelled +5V
Unconnected: SW1.1 T4.2 U1.1(NC_3) U1.20(NC_9) U1.72(NC) U1.86(NC_4) U1.87(NC_5) U1.93(NC_6) U1.97(NC_7) U1.98(NC_2) U1.99(NC_8) U1.100(NC_10) U2.1(NC_3) U2.20(NC_9) U2.72(NC) U2.86(NC_4) U2.87(NC_5) U2.93(NC_6) U2.97(NC_7) U2.98(NC_2) U2.99(NC_8) U2.100(NC_10)

## Power pins joined to a net without a drawn wire
GND: PS1.2(GND) PS1.5(GND) PS1.6(GND)

## Library data of the parts
C1 C9 C12 C13 C15 C18 C21 C22 C29-C31 C33 C34 C38 C39 C42 C46-C49 C111 C112 C116 C117 = SamacSys_Parts:T489A106K010ATA2K2: Tantalum Capacitors - Solid SMD 10V 10uF 1206 10% Source: Datasheet <https://www.mouser.in/datasheet/2/212/KEM_T2057_T489_AUTO-1774984.pdf>; DESCRIPTION: Tantalum Capacitors - Solid SMD 10V 10uF 1206 10%; HEIGHT: 1.8mm; MANUFACTURER_NAME: Kemet; MANUFACTURER_PART_NUMBER: T489A106K010ATA2K2; MOUSER_PART_NUMBER: 80-T489A106K10ATA2K2; MOUSER_PRICE-STOCK: https://www.mouser.co.uk/ProductDetail/KEMET/T489A106K010ATA2K2?qs=ds50AKTGxA%2Fc9bL0zBpU2Q%3D%3D
C2-C8 C14 C16 C17 C20 C51 C52 C64-C73 C77-C81 C83-C98 = GRM022R60G104ME15L:GRM022R60G104ME15L: 01005 4 V 0.1 uF ±20% Tolerance X5R Ceramic Capacitor Check prices <https://pricing.snapeda.com/parts/GRM022R60G104ME15L/Murata/view-part?ref=eda>; AVAILABILITY: In Stock; DESCRIPTION: SMD Capacitor X5R(EIA) with Capacitance: 0.10uF Tol. 20%. Rated Voltage: 4Vdc; MF: Murata; MP: GRM022R60G104ME15L; PACKAGE: 0402 Murata; PRICE: None; PURCHASE-URL: https://pricing.snapeda.com/search/part/GRM022R60G104ME15L/?ref=eda
C10 C23 C35 C37 C40 C45 C107-C110 C115 C120 = SamacSys_Parts:T491A226K010ATAUTO: Automotive and Industrial Grade Tantalum Capacitors Source: Datasheet <https://www.arrow.com/en/products/t491a226k010atauto/kemet-corporation>; DESCRIPTION: Automotive and Industrial Grade Tantalum Capacitors; HEIGHT: 1.8mm; MANUFACTURER_NAME: Kemet; MANUFACTURER_PART_NUMBER: T491A226K010ATAUTO; MOUSER_PART_NUMBER: 80-T491A226K10ATAUTO; MOUSER_PRICE-STOCK: https://www.mouser.co.uk/ProductDetail/KEMET/T491A226K010ATAUTO?qs=ds50AKTGxA8UD0p2cTZXRg%3D%3D
C11 C19 C24 C32 C36 C41 C43 C44 C74-C76 C82 = SamacSys_Parts:GRM152D80G105ME15D: Cap Ceramic 1uF 4V X6T 20% Pad SMD 0402 105C T/R Source: Datasheet <https://componentsearchengine.com/Datasheets/1/GRM152D80G105ME15D.pdf>; DESCRIPTION: Cap Ceramic 1uF 4V X6T 20% Pad SMD 0402 105C T/R; HEIGHT: 0.22mm; MANUFACTURER_NAME: Murata Electronics; MANUFACTURER_PART_NUMBER: GRM152D80G105ME15D; MOUSER_PART_NUMBER: 81-GRM152D80G105ME5D; MOUSER_PRICE-STOCK: https://www.mouser.com/Search/Refine.aspx?Keyword=81-GRM152D80G105ME5D
C25 C53 C102 C103 C122 C125 = SamacSys_Parts:GQM2195C2E2R7CB12D: Capacitor GQM21 L=2.0mm W=1.25mm T=0.85mm Source: Datasheet <https://psearch.en.murata.com/capacitor/product/GQM2195C2E2R7CB12#.html>; DESCRIPTION: Capacitor GQM21 L=2.0mm W=1.25mm T=0.85mm; HEIGHT: 1mm; MANUFACTURER_NAME: Murata Electronics; MANUFACTURER_PART_NUMBER: GQM2195C2E2R7CB12D; MOUSER_PART_NUMBER: 81-GQM2195C2E2R7CB2D; MOUSER_PRICE-STOCK: https://www.mouser.co.uk/ProductDetail/Murata-Electronics/GQM2195C2E2R7CB12D?qs=UoPT7wUmgYKXvDmMgBfFNA%3D%3D
C26 C54 C99 C104 C121 C124 = SamacSys_Parts:GQM2195C2E5R6CB12D: Capacitor GQM21 L=2.0mm W=1.25mm T=0.85mm Source: Datasheet <https://componentsearchengine.com/Datasheets/1/GQM2195C2E5R6CB12D.pdf>; DESCRIPTION: Capacitor GQM21 L=2.0mm W=1.25mm T=0.85mm; HEIGHT: 1mm; MANUFACTURER_NAME: Murata Electronics; MANUFACTURER_PART_NUMBER: GQM2195C2E5R6CB12D; MOUSER_PART_NUMBER: 81-GQM2195C2E5R6CB2D; MOUSER_PRICE-STOCK: https://www.mouser.com/Search/Refine.aspx?Keyword=81-GQM2195C2E5R6CB2D
C27 C55 C100 C105 = SamacSys_Parts:GQM2195C2E6R8CB12D: Capacitor GQM21 L=2.0mm W=1.25mm T=0.85mm Source: Datasheet <https://componentsearchengine.com/Datasheets/1/GQM2195C2E6R8CB12D.pdf>; DESCRIPTION: Capacitor GQM21 L=2.0mm W=1.25mm T=0.85mm; HEIGHT: 1mm; MANUFACTURER_NAME: Murata Electronics; MANUFACTURER_PART_NUMBER: GQM2195C2E6R8CB12D; MOUSER_PART_NUMBER: 81-GQM2195C2E6R8CB2D; MOUSER_PRICE-STOCK: https://www.mouser.com/Search/Refine.aspx?Keyword=81-GQM2195C2E6R8CB2D
C28 C56 C101 C106 = SamacSys_Parts:GQM2195C2E3R9BB12D: Capacitor GQM21 L=2.0mm W=1.25mm T=0.85mm Source: Datasheet <https://psearch.en.murata.com/capacitor/product/GQM2195C2E3R9BB12#.html>; DESCRIPTION: Capacitor GQM21 L=2.0mm W=1.25mm T=0.85mm; HEIGHT: 1mm; MANUFACTURER_NAME: Murata Electronics; MANUFACTURER_PART_NUMBER: GQM2195C2E3R9BB12D
C50 C57-C63 C113 C114 C118 C119 = SamacSys_Parts:GRMMDXR60J105ME05D: Multilayer Ceramic Capacitors MLCC - SMD/SMT 015008 1uF 6.3V X5R Derate Mobile Only Source: Datasheet; DESCRIPTION: Multilayer Ceramic Capacitors MLCC - SMD/SMT 015008 1uF 6.3V X5R Derate Mobile Only; HEIGHT: 0.275mm; MANUFACTURER_NAME: Murata Electronics; MANUFACTURER_PART_NUMBER: GRMMDXR60J105ME05D; MOUSER_PART_NUMBER: 81-GRMMDXR60J105ME5D; MOUSER_PRICE-STOCK: https://www.mouser.co.uk/ProductDetail/Murata-Electronics/GRMMDXR60J105ME05D?qs=%252Bdbji%2FA6pC8gun9kUCdQZQ%3D%3D
C123 C126 = SamacSys_Parts:GQM2195C2E1R0BB12D: Capacitor GQM21 L=2.0mm W=1.25mm T=0.85mm Source: Datasheet <https://psearch.en.murata.com/capacitor/product/GQM2195C2E1R0BB12#.html>; DESCRIPTION: Capacitor GQM21 L=2.0mm W=1.25mm T=0.85mm; HEIGHT: 1mm; MANUFACTURER_NAME: Murata Electronics; MANUFACTURER_PART_NUMBER: GQM2195C2E1R0BB12D; MOUSER_PART_NUMBER: 81-GQM2195C2E1R0BB2D; MOUSER_PRICE-STOCK: https://www.mouser.co.uk/ProductDetail/Murata-Electronics/GQM2195C2E1R0BB12D?qs=0JbGSuRBwBMnApsOp1GTOg%3D%3D
CLK_INPUT+ PDCLK1 PDCLK2 SYNC_CLK1 SYNC_CLK2 SYNC_IN+1 SYNC_IN+2 SYNC_IN-1 SYNC_IN-2 SYNC_OUT+1 SYNC_OUT+2 SYNC_OUT-1 SYNC_OUT-2 = con-coax:BU-SMA-V: FEMALE SMA CONNECTOR Radiall distributor RS 112-3794; OC_FARNELL: unknown; OC_NEWARK: unknown
D1 = SamacSys_Parts:SMBJ5340B-TP: Diode Zener Single 6V 5% 5W 2-Pin SMB T/R Source: Datasheet <https://www.arrow.com/en/products/smbj5340b-tp/micro-commercial-components>; DESCRIPTION: Diode Zener Single 6V 5% 5W 2-Pin SMB T/R; HEIGHT: 2.41mm; MANUFACTURER_NAME: Micro Commercial Components (MCC); MANUFACTURER_PART_NUMBER: SMBJ5340B-TP; MOUSER_PART_NUMBER: 833-SMBJ5340B-TP; MOUSER_PRICE-STOCK: https://www.mouser.co.uk/ProductDetail/Micro-Commercial-Components-MCC/SMBJ5340B-TP?qs=ZNK0BnemlqHJq1hQMWEIvQ%3D%3D
FERRITE_BEAD_1-FERRITE_BEAD_12 = Wurth_Elektronik_Passive_rev15d:WE-CBF: WE-CBF SMD EMI Suppression Ferrite Bead Characteristics Reliable Ni-Sn electrodes High rated current up to 6 A Operating temperature: –55 ºC to +125 ºC Applications Perfect as data lined filter and for uncoupling of distribution voltage Variant abbreviation WB means WIDE BAND HS means HIGH SPEED HC means HIGH CURRENT <http://katalog.we-online.de/media/images/eisos/FeCBF_pf2.jpg> Details see: http://katalog.we-online.de/en/pbs/WE-CBF Updated on 2014-06-19 2014 (C) Wurth Elektronik
FILTERED_OUT FILTERED_OUT2 = con-coax:BU-SMA-H: FEMALE SMA CONNECTOR Radiall; OC_FARNELL: unknown; OC_NEWARK: unknown
J1 = KLDX-0202-AC:KLDX-0202-AC: Conn Power PIN 2 POS Solder RA Thru-Hole 3 Terminal 1 Port Check prices <https://pricing.snapeda.com/parts/KLDX-0202-AC/Kycon/view-part?ref=eda>; AVAILABILITY: In Stock; DESCRIPTION: Power Barrel Connector Jack 2.00mm ID (0.079), 5.50mm OD (0.217) Through Hole, Right Angle; MF: Kycon; MP: KLDX-0202-AC; PACKAGE: DIP-20 Kycon; PRICE: None; PURCHASE-URL: https://pricing.snapeda.com/search/part/KLDX-0202-AC/?ref=eda
L1 L4 = SamacSys_Parts:LQW2BAS18NJ00L: Murata LQW Series Shielded Wire-wound SMD Inductor with a Non-Magnetic Core Core, 18 nH +/-5% 600mA Idc Q:50 Source: Datasheet <https://psearch.en.murata.com/inductor/product/LQW2BAS18NJ00#.html>; DESCRIPTION: Murata LQW Series Shielded Wire-wound SMD Inductor with a Non-Magnetic Core Core, 18 nH +/-5% 600mA Idc Q:50; HEIGHT: 1.52mm; MANUFACTURER_NAME: Murata Electronics; MANUFACTURER_PART_NUMBER: LQW2BAS18NJ00L; MOUSER_PART_NUMBER: 81-LQW2BAS18NJ00L; MOUSER_PRICE-STOCK: https://www.mouser.co.uk/ProductDetail/Murata-Electronics/LQW2BAS18NJ00L?qs=XY81OjNnpal2Dbjq17m9Aw%3D%3D
L2 L5 = SamacSys_Parts:LQW2BAS22NJ00L: LQW2BAS_00 Series Inductor 22nH +/-5% 0805 (2015) Source: Datasheet <https://psearch.en.murata.com/inductor/product/LQW2BAS22NJ00#.html>; DESCRIPTION: LQW2BAS_00 Series Inductor 22nH +/-5% 0805 (2015); HEIGHT: 1.52mm; MANUFACTURER_NAME: Murata Electronics; MANUFACTURER_PART_NUMBER: LQW2BAS22NJ00L; MOUSER_PART_NUMBER: 81-LQW2BAS22NJ00L; MOUSER_PRICE-STOCK: https://www.mouser.co.uk/ProductDetail/Murata-Electronics/LQW2BAS22NJ00L?qs=XY81OjNnpakP8WjAEakWZg%3D%3D
L3 L6 = SamacSys_Parts:LQW2BAS27NJ00L: Murata LQW Series Shielded Wire-wound SMD Inductor with a Non-Magnetic Core Core, 27 nH +/-5% 500mA Idc Q:55 Source: Datasheet <https://componentsearchengine.com/Datasheets/1/LQW2BAS27NJ00L.pdf>; DESCRIPTION: Murata LQW Series Shielded Wire-wound SMD Inductor with a Non-Magnetic Core Core, 27 nH +/-5% 500mA Idc Q:55; HEIGHT: 1.52mm; MANUFACTURER_NAME: Murata Electronics; MANUFACTURER_PART_NUMBER: LQW2BAS27NJ00L; MOUSER_PART_NUMBER: 81-LQW2BAS27NJ00L; MOUSER_PRICE-STOCK: https://www.mouser.com/Search/Refine.aspx?Keyword=81-LQW2BAS27NJ00L
LED5 = SamacSys_Parts:SML-811UTT86C: Standard LEDs - SMD Red 620nm 22.4mcd 1.95V; 10mA; 1305 Source: Datasheet <https://componentsearchengine.com/Datasheets/2/SML-811UTT86C.pdf>; DESCRIPTION: Standard LEDs - SMD Red 620nm 22.4mcd 1.95V; 10mA; 1305; HEIGHT: 1.15mm; MANUFACTURER_NAME: ROHM Semiconductor; MANUFACTURER_PART_NUMBER: SML-811UTT86C; MOUSER_PART_NUMBER: 755-SML-811UTT86C; MOUSER_PRICE-STOCK: https://www.mouser.co.uk/ProductDetail/ROHM-Semiconductor/SML-811UTT86C?qs=HXFqYaX1Q2xu8Cp2wXlRjA%3D%3D
PARALLEL1 PARALLEL2 = SamacSys_Parts:TSM-119-04-L-DV: 38 Position, Dual-Row, .100" Surface Mount Terminal Strip Source: Datasheet <http://suddendocs.samtec.com/prints/tsm-1xx-xx-xxx-xx-x-xxx-x-mkt.pdf>; DESCRIPTION: 38 Position, Dual-Row, .100&quot; Surface Mount Terminal Strip; HEIGHT: mm; MANUFACTURER_NAME: SAMTEC; MANUFACTURER_PART_NUMBER: TSM-119-04-L-DV
PROFILE SPI_CTRL = SamacSys_Parts:M20-8760842P: Headers & Wire Housings 08+08 DIL VERTICAL SMT HEADER GOLD+TIN Source: Datasheet <https://cdn.harwin.com/pdfs/M20-876P.pdf>; DESCRIPTION: Headers & Wire Housings 08+08 DIL VERTICAL SMT HEADER GOLD+TIN; HEIGHT: 10mm; MANUFACTURER_NAME: Harwin; MANUFACTURER_PART_NUMBER: M20-8760842P; MOUSER_PART_NUMBER: 855-M20-8760842P; MOUSER_PRICE-STOCK: https://www.mouser.co.uk/ProductDetail/Harwin/M20-8760842P?qs=WS5Jv%252B%252Bx1qXNtQgChMtRWw%3D%3D
PS1 = minicircuits:ADP-2-10: Power Splitter/Combiner 2 Way-0° 50 R Aqueous washable. For non-aquesous requirements, LRPS units available in case style QQQ130 Internal load dissipation: 0.125 Watt Matched power rating: 0.5 Watt Non-hermetic ADP-2-10 2 Way-0° Frequency MHz Isolation, dB Insertion Loss, dB Above 3.0dB Phase Unbalance Degrees Amplitude Unbalance, dB Power Input, W fL - fU L Typ. Min. M Typ. Min. U Typ. Min. L Typ. Max. M Typ. Max. U Typ. Max. L Max. M Max. U Max. L Max. M Max. U Max. as Combiner Max. as Splitter Max. 5.00-1000 25 15 23 15 20 15 0.30 0.90 0.40 0.90 0.60 1.20 2.00 2.00 3.00 0.20 0.20 0.30 0.50 L=low range(fL to 10fL) M=mid range(10fL to fU/2) U=upper range(fU/2 to fU) FREQ (MHz) Insertion Loss Amplitude Unbalance (dB) Isolation Phase Unbalance (Degrees) FREQ (MHz) VSWR S VSWR 1 VSWR 2 (dB) S-1 (dB) S-2 (dB) 1-2 5.000 3.22 3.23 0.010 22.55 0.06 5.00 1.04 1.24 1.24 5.500 3.24 3.23 0.000 23.00 0.03 5.50 1.04 1.23 1.23 6.000 3.22 3.22 0.010 23.37 0.10 6.00 1.03 1.22 1.22 6.500 3.23 3.23 0.000 23.72 0.00 6.50 1.03 1.22 1.22 7.000 3.23 3.23 0.000 24.03 0.06 7.00 1.03 1.21 1.21 7.500 3.23 3.23 0.010 24.31 0.03 7.50 1.03 1.21 1.21 8.000 3.23 3.23 0.000 24.55 0.03 8.00 1.03 1.20 1.20 8.500 3.22 3.22 0.000 24.77 0.04 8.50 1.03 1.20 1.20 9.000 3.23 3.23 0.000 24.97 0.04 9.00 1.03 1.19 1.19 9.500 3.22 3.23 0.000 25.15 0.03 9.50 1.03 1.19 1.19 10.00 3.23 3.23 0.000 25.33 0.03 10.00 1.03 1.19 1.19 15.00 3.22 3.22 0.000 26.32 0.04 15.00 1.03 1.17 1.17 20.00 3.23 3.22 0.010 26.71 0.06 20.00 1.03 1.17 1.17 25.00 3.23 3.23 0.000 26.82 0.02 25.00 1.03 1.16 1.16 30.00 3.24 3.24 0.010 26.82 0.05 30.00 1.03 1.16 1.16 40.00 3.26 3.26 0.000 26.75 0.14 40.00 1.03 1.16 1.16 50.00 3.26 3.26 0.000 26.58 0.06 50.00 1.03 1.16 1.16 60.00 3.28 3.27 0.010 26.40 0.05 60.00 1.04 1.16 1.16 70.00 3.28 3.29 0.010 26.21 0.07 70.00 1.04 1.16 1.16 80.00 3.28 3.28 0.000 26.00 0.14 80.00 1.04 1.16 1.16 90.00 3.27 3.29 0.020 25.80 0.07 90.00 1.05 1.16 1.16 100.00 3.28 3.28 0.000 25.58 0.15 100.00 1.05 1.16 1.16 150.00 3.32 3.33 0.010 24.51 0.21 150.00 1.07 1.16 1.16 200.00 3.37 3.37 0.000 23.58 0.34 200.00 1.09 1.16 1.15 250.00 3.36 3.36 0.010 22.61 0.39 250.00 1.11 1.16 1.15 300.00 3.43 3.43 0.000 21.92 0.46 300.00 1.13 1.16 1.15 350.00 3.41 3.41 0.000 21.19 0.57 350.00 1.14 1.16 1.14 400.00 3.51 3.49 0.020 20.71 0.53 400.00 1.15 1.16 1.13 450.00 3.49 3.48 0.000 20.24 0.66 450.00 1.16 1.15 1.12 500.00 3.52 3.51 0.010 19.88 0.61 500.00 1.17 1.15 1.11 550.00 3.56 3.54 0.020 19.64 0.76 550.00 1.18 1.14 1.10 600.00 3.56 3.56 0.000 19.43 0.70 600.00 1.18 1.13 1.09 650.00 3.60 3.58 0.020 19.39 0.75 650.00 1.18 1.12 1.07 700.00 3.63 3.61 0.020 19.44 0.92 700.00 1.18 1.11 1.06 750.00 3.66 3.65 0.010 19.60 0.73 750.00 1.17 1.10 1.05 800.00 3.72 3.71 0.020 19.90 0.81 800.00 1.17 1.09 1.05 850.00 3.70 3.68 0.020 20.39 0.92 850.00 1.16 1.09 1.06 900.00 3.75 3.75 0.010 20.93 0.86 900.00 1.16 1.09 1.08 950.00 3.79 3.76 0.030 21.81 0.69 950.00 1.16 1.10 1.11 1000.00 3.91 3.89 0.020 22.86 0.89 1000.00 1.17 1.12 1.14
PWR_DWN = SamacSys_Parts:67996-106HLF: Headers & Wire Housings BERGSTIK HDR Source: Datasheet <https://www.arrow.com/en/products/67996-106hlf/amphenol-fci>; DESCRIPTION: Headers & Wire Housings BERGSTIK HDR; HEIGHT: 8.58mm; MANUFACTURER_NAME: Amphenol; MANUFACTURER_PART_NUMBER: 67996-106HLF; MOUSER_PART_NUMBER: 649-67996-106HLF; MOUSER_PRICE-STOCK: https://www.mouser.co.uk/ProductDetail/Amphenol-FCI/67996-106HLF?qs=zh4O8xspOuxvaXUEpggJSw%3D%3D
R1 R7 R13 R14 = SamacSys_Parts:TNPW020150R0BEED: Thin Film Resistors - SMD 50ohms 0.1% 25ppm Source: Datasheet <https://www.mouser.co.za/datasheet/2/427/tnpw_e3-1879236.pdf>; DESCRIPTION: Thin Film Resistors - SMD 50ohms 0.1% 25ppm; HEIGHT: 0.26mm; MANUFACTURER_NAME: Vishay; MANUFACTURER_PART_NUMBER: TNPW020150R0BEED; MOUSER_PART_NUMBER: 71-TNPW020150R0BEED; MOUSER_PRICE-STOCK: https://www.mouser.co.uk/ProductDetail/Vishay-Dale/TNPW020150R0BEED?qs=zW32dvEIR3uKPPeRKLg%2FXA%3D%3D
R6 R17 = SamacSys_Parts:TNPU040210K0AYEP00: Thin Film Resistors - SMD 1/16w 10Kohms .05% 10ppm Source: Datasheet <https://componentsearchengine.com/Datasheets/1/TNPU040210K0AYEP00.pdf>; DESCRIPTION: Thin Film Resistors - SMD 1/16w 10Kohms .05% 10ppm; HEIGHT: 0.4mm; MANUFACTURER_NAME: Vishay; MANUFACTURER_PART_NUMBER: TNPU040210K0AYEP00; MOUSER_PART_NUMBER: 71-TNPU040210K0AYEP0; MOUSER_PRICE-STOCK: https://www.mouser.co.uk/ProductDetail/Vishay-Draloric/TNPU040210K0AYEP00?qs=Cb2nCFKsA8o64Yl%2FhMqniA%3D%3D
R15 R16 R41 R42 = SamacSys_Parts:CRCW020124R9FNED: Thick Film Resistors - SMD 1/20watt 24.9ohms 1% 200ppm Source: Datasheet <https://componentsearchengine.com/Datasheets/1/CRCW020124R9FNED.pdf>; DESCRIPTION: Thick Film Resistors - SMD 1/20watt 24.9ohms 1% 200ppm; HEIGHT: 0.28mm; MANUFACTURER_NAME: Vishay; MANUFACTURER_PART_NUMBER: CRCW020124R9FNED; MOUSER_PART_NUMBER: 71-CRCW020124R9FNED; MOUSER_PRICE-STOCK: http://www.mouser.com/Search/ProductDetail.aspx?qs=4bbongekVISWsebyAjaWuw%3d%3d
R27 = ERA3VEB3000V:ERA3VEB3000V: Check prices <https://pricing.snapeda.com/parts/ERA-3VEB3000V/Panasonic/view-part?ref=eda>; AVAILABILITY: In Stock; DESCRIPTION: Thin Film Chip Resistors, High Stability and Reliability Type, ERA3V Series, 0.3K Ohm +/-0.1% , 0.125W , 0603 size , chip resistor (1.6 x 0.8 x 0.45mm); MF: Panasonic; MP: ERA-3VEB3000V; PACKAGE: 1608-2 Panasonic; PRICE: None; PURCHASE-URL: https://pricing.snapeda.com/search/part/ERA-3VEB3000V/?ref=eda
R29 R36 = SamacSys_Parts:CRCW0402100RFKEDC: VISHAY - CRCW0402100RFKEDC - D10/CRCW0402-C 100 100R 1% ET7 E3 Source: Datasheet <https://www.mouser.co.uk/datasheet/2/427/crcwce3-1223726.pdf>; DESCRIPTION: VISHAY - CRCW0402100RFKEDC - D10/CRCW0402-C 100 100R 1% ET7 E3; HEIGHT: 0.35mm; MANUFACTURER_NAME: Vishay; MANUFACTURER_PART_NUMBER: CRCW0402100RFKEDC; MOUSER_PART_NUMBER: 71-CRCW0402100RFKEDC; MOUSER_PRICE-STOCK: https://www.mouser.co.uk/ProductDetail/Vishay-Dale/CRCW0402100RFKEDC?qs=E3Y5ESvWgWO1aKOdrdIvbA%3D%3D
RAMP1 RAMP2 = SamacSys_Parts:M20-8760342R: 2.54mm (0.1") Pitch DIL SMT Pin Header, selective gold + tin, pick & place (Tape & Reel packing), 3+3 contacts Source: Datasheet <https://cdn.harwin.com/pdfs/M20-876R.pdf>; DESCRIPTION: 2.54mm (0.1") Pitch DIL SMT Pin Header, selective gold + tin, pick & place (Tape & Reel packing), 3+3 contacts; HEIGHT: 11.5mm; MANUFACTURER_NAME: Harwin; MANUFACTURER_PART_NUMBER: M20-8760342R; MOUSER_PART_NUMBER: 855-M20-8760342R; MOUSER_PRICE-STOCK: https://www.mouser.co.uk/ProductDetail/Harwin/M20-8760342R?qs=vF78I%252BjhbY%2F5VOL01aBOqA%3D%3D
REG1 REG2 REG4 REG6-REG8 REG10 REG12 = SamacSys_Parts:AZ1117CH-1.8TRG1: DiodesZetex AZ1117CH-1.8TRG1, LDO Regulator, 800mA, 1.8 V +/-1%, maximum of 15 Vin, 3 + Tab-Pin SOT-223 Source: Datasheet; DESCRIPTION: DiodesZetex AZ1117CH-1.8TRG1, LDO Regulator, 800mA, 1.8 V +/-1%, maximum of 15 Vin, 3 + Tab-Pin SOT-223; HEIGHT: 1.8mm; MANUFACTURER_NAME: Diodes Inc.; MANUFACTURER_PART_NUMBER: AZ1117CH-1.8TRG1; MOUSER_PART_NUMBER: 621-AZ1117CH-1.8TRG1; MOUSER_PRICE-STOCK: https://www.mouser.co.uk/ProductDetail/Diodes-Incorporated/AZ1117CH-18TRG1/?qs=FKu9oBikfSnQe2AxzMSDiQ%3D%3D
REG3 REG5 REG9 REG11 = SamacSys_Parts:TPS7B8333QDCYRQ1: LDO Voltage Regulators Automotive 150-mA, 40-V, ultra-low-IQ, low-dropout (LDO) linear regulator 4-SOT-223 -40 to 125 Source: Datasheet <https://www.ti.com/lit/ds/symlink/tps7b83-q1.pdf?ts=1623315769706&ref_url=https%3A%2F%2Fwww.google.com%2F>; DESCRIPTION: LDO Voltage Regulators Automotive 150-mA, 40-V, ultra-low-IQ, low-dropout (LDO) linear regulator 4-SOT-223 -40 to 125; HEIGHT: 1.8mm; MANUFACTURER_NAME: Texas Instruments; MANUFACTURER_PART_NUMBER: TPS7B8333QDCYRQ1; MOUSER_PART_NUMBER: 595-TPS7B8333QDCYRQ1; MOUSER_PRICE-STOCK: https://www.mouser.co.uk/ProductDetail/Texas-Instruments/TPS7B8333QDCYRQ1?qs=81r%252BiQLm7BRMqU6pzBTdwQ%3D%3D
SW1 = 100SP1T2B4M6QE:100SP1T2B4M6QE: Toggle Switch SPDT Through Hole, Right Angle 5A 120V Check prices <https://pricing.snapeda.com/parts/100SP1T2B4M6QE/E-Switch/view-part?ref=eda>; AVAILABILITY: In Stock; DESCRIPTION: Toggle Switch, 100 Series, SPDT, ON-NONE-ON, Sealed, 5A, 120VAC, 28VDC, R/A PC; MF: E-Switch; MP: 100SP1T2B4M6QE; PACKAGE: None; PRICE: None; PURCHASE-URL: https://pricing.snapeda.com/search/part/100SP1T2B4M6QE/?ref=eda
T1 T4 = TC2-72T+:TC2-72T+; COPYRIGHT: Copyright (C) 2022 Ultra Librarian. All rights reserved.; MANUFACTURER_PART_NUMBER: TC2-72T+; MFR_NAME: Mini Circuits
T2 T3 = ETC1-1-13TR:ETC1-1-13TR: RF 1:1 Transmission Line Transformer 4.5 - 3000 MHz Check availability <https://pricing.snapeda.com/parts/ETC1-1-13TR/M/A-Com%20Technology/view-part?ref=eda>; AVAILABILITY: In Stock; DESCRIPTION: RF Balun 4.5MHz ~ 3GHz 1:1 5-SMD; MF: M/A-Com Technology; MP: ETC1-1-13TR; PACKAGE: SMD-5 MA-COM; PRICE: None; PURCHASE-URL: https://pricing.snapeda.com/search/part/ETC1-1-13TR/?ref=eda
TP1-TP10 = testpad:TP: Test pad
U1 U2 = AD9910BSVZ:AD9910BSVZ: TQFP-100,Direct Digital Synthesizer Check prices <https://pricing.snapeda.com/parts/AD9910BSVZ/Analog%20Devices/view-part?ref=eda>; AVAILABILITY: In Stock; DESCRIPTION: Direct Digital Synthesis IC 14 b 1GHz 32 b Tuning 100-TQFP-EP (14x14); MF: Analog Devices; MP: AD9910BSVZ; PACKAGE: TQFP -100 Analog Devices; PRICE: None

## Net classes
1 diff: width 0.105 mm, drill 0.008 mm, clearance 0.15 mm
2 ground: drill 0.3 mm
3 single: width 0.145 mm, drill 0.3 mm, clearance 0.15 mm